# EAGLE design lpm (EAGLE 7.7.0)

## Sheet 1 of 6: Input - Relay
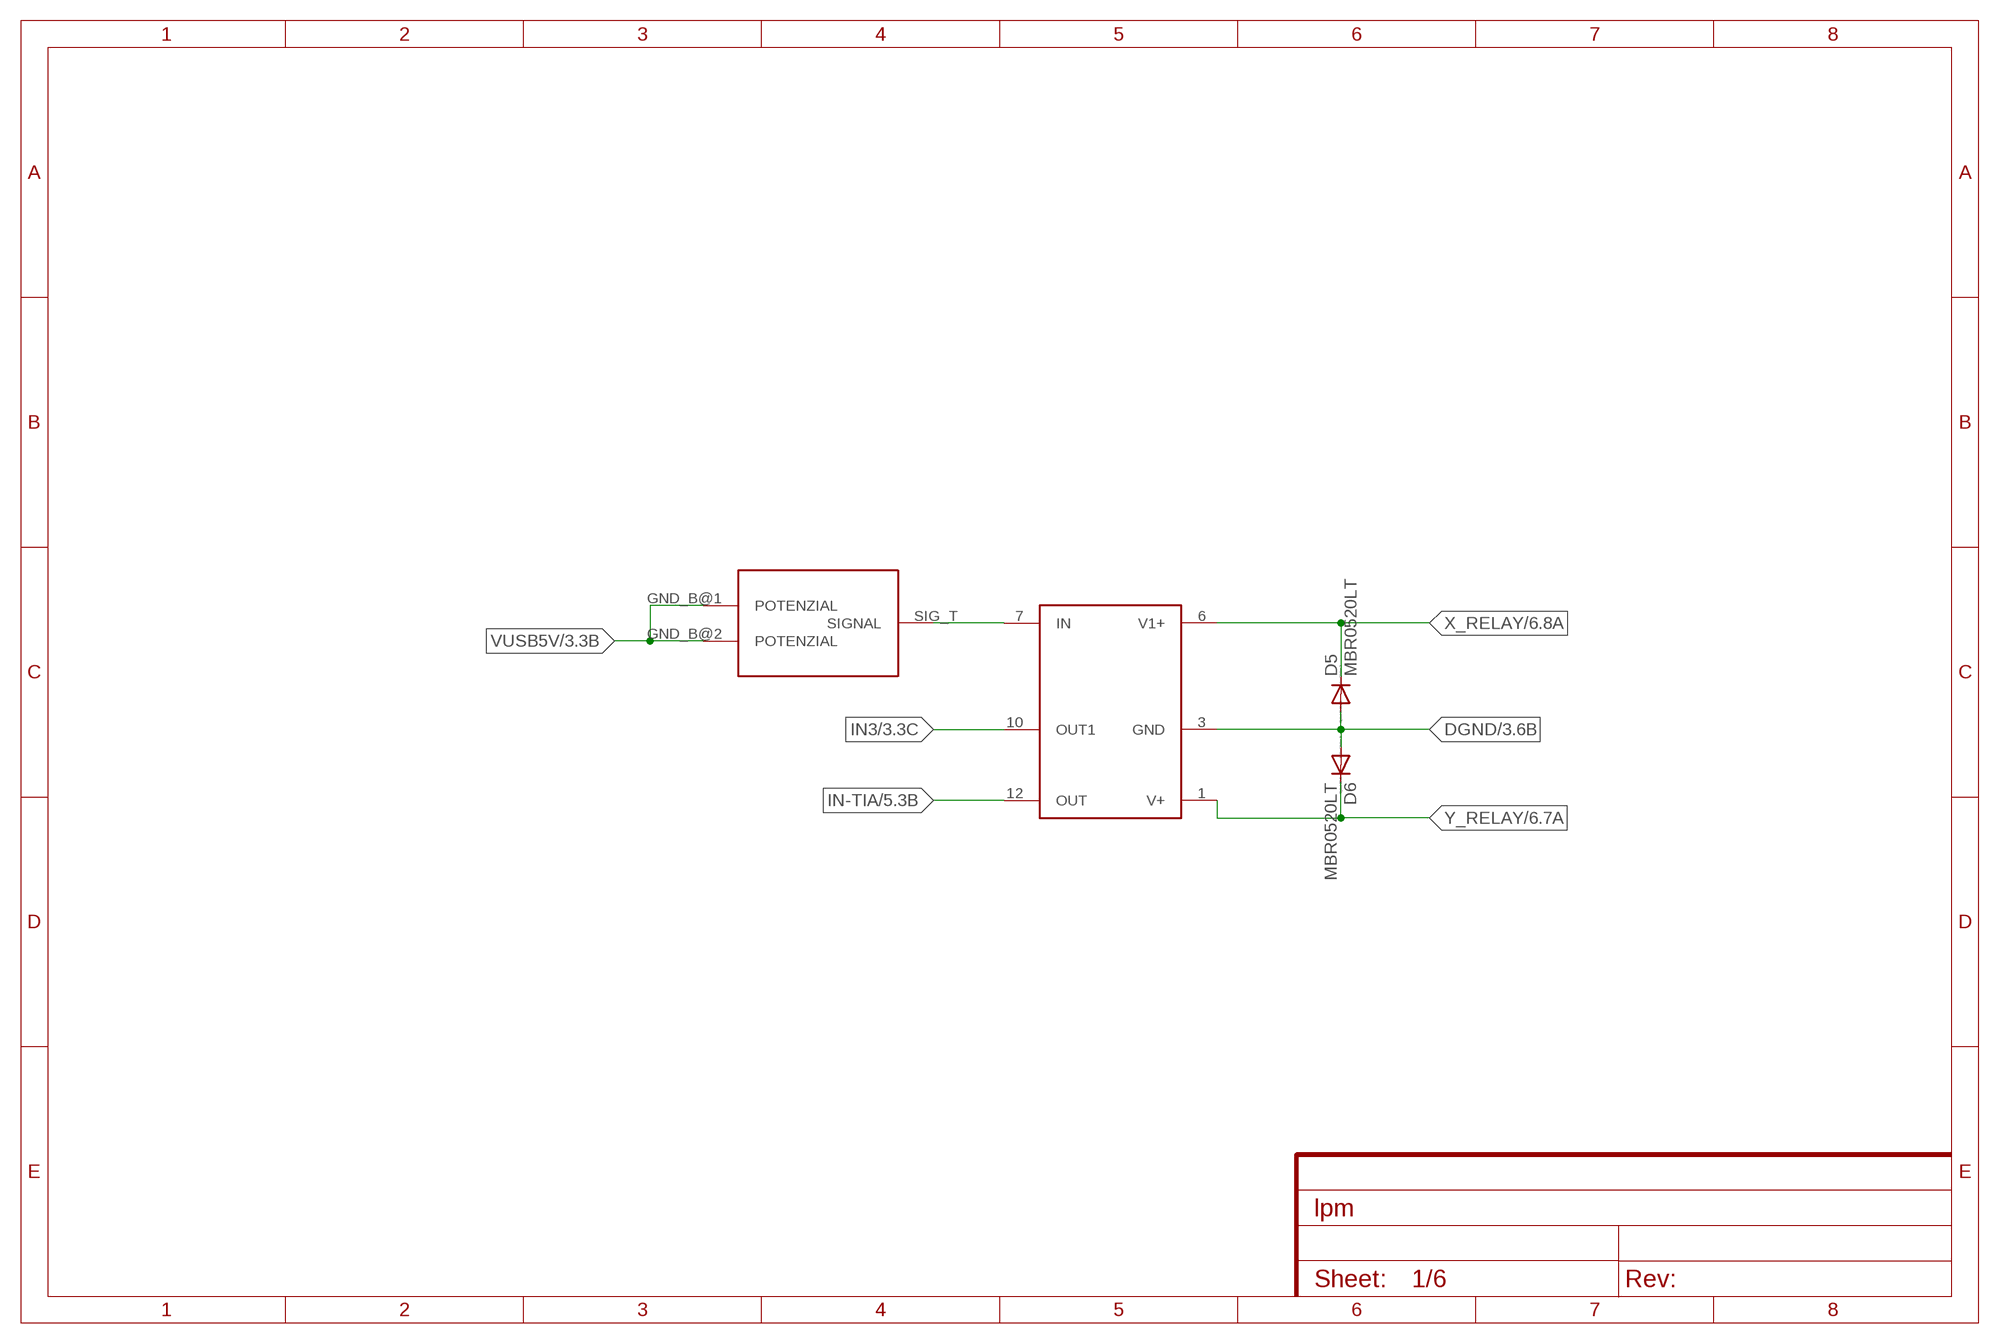
[diagram p0: schematic, sheet 1]

### Parts
D5  MBR0520LT  [SOD123]
D6  MBR0520LT  [SOD123]
RELAY  DS1E  [DIP12_8MM_X_13MM_DS1E]
U$8  SMA_RAND  [SMA-RAND-PRINT]

### Nets
DGND: D5.A D6.A RELAY.3(GND) ; also sheet 3,4,6
IN3: RELAY.10(OUT1) ; also sheet 3
IN-TIA: RELAY.12(OUT) ; also sheet 5
IPD: RELAY.7(IN) U$8.SIG_T(SIGNAL)
VUSB5V: U$8.GND_B@1(POTENZIAL) U$8.GND_B@2(POTENZIAL) ; also sheet 3,4,6
X_RELAY: D5.C RELAY.6(V1+) ; also sheet 6
Y_RELAY: D6.C RELAY.1(V+) ; also sheet 6

## Sheet 2 of 6: VFC
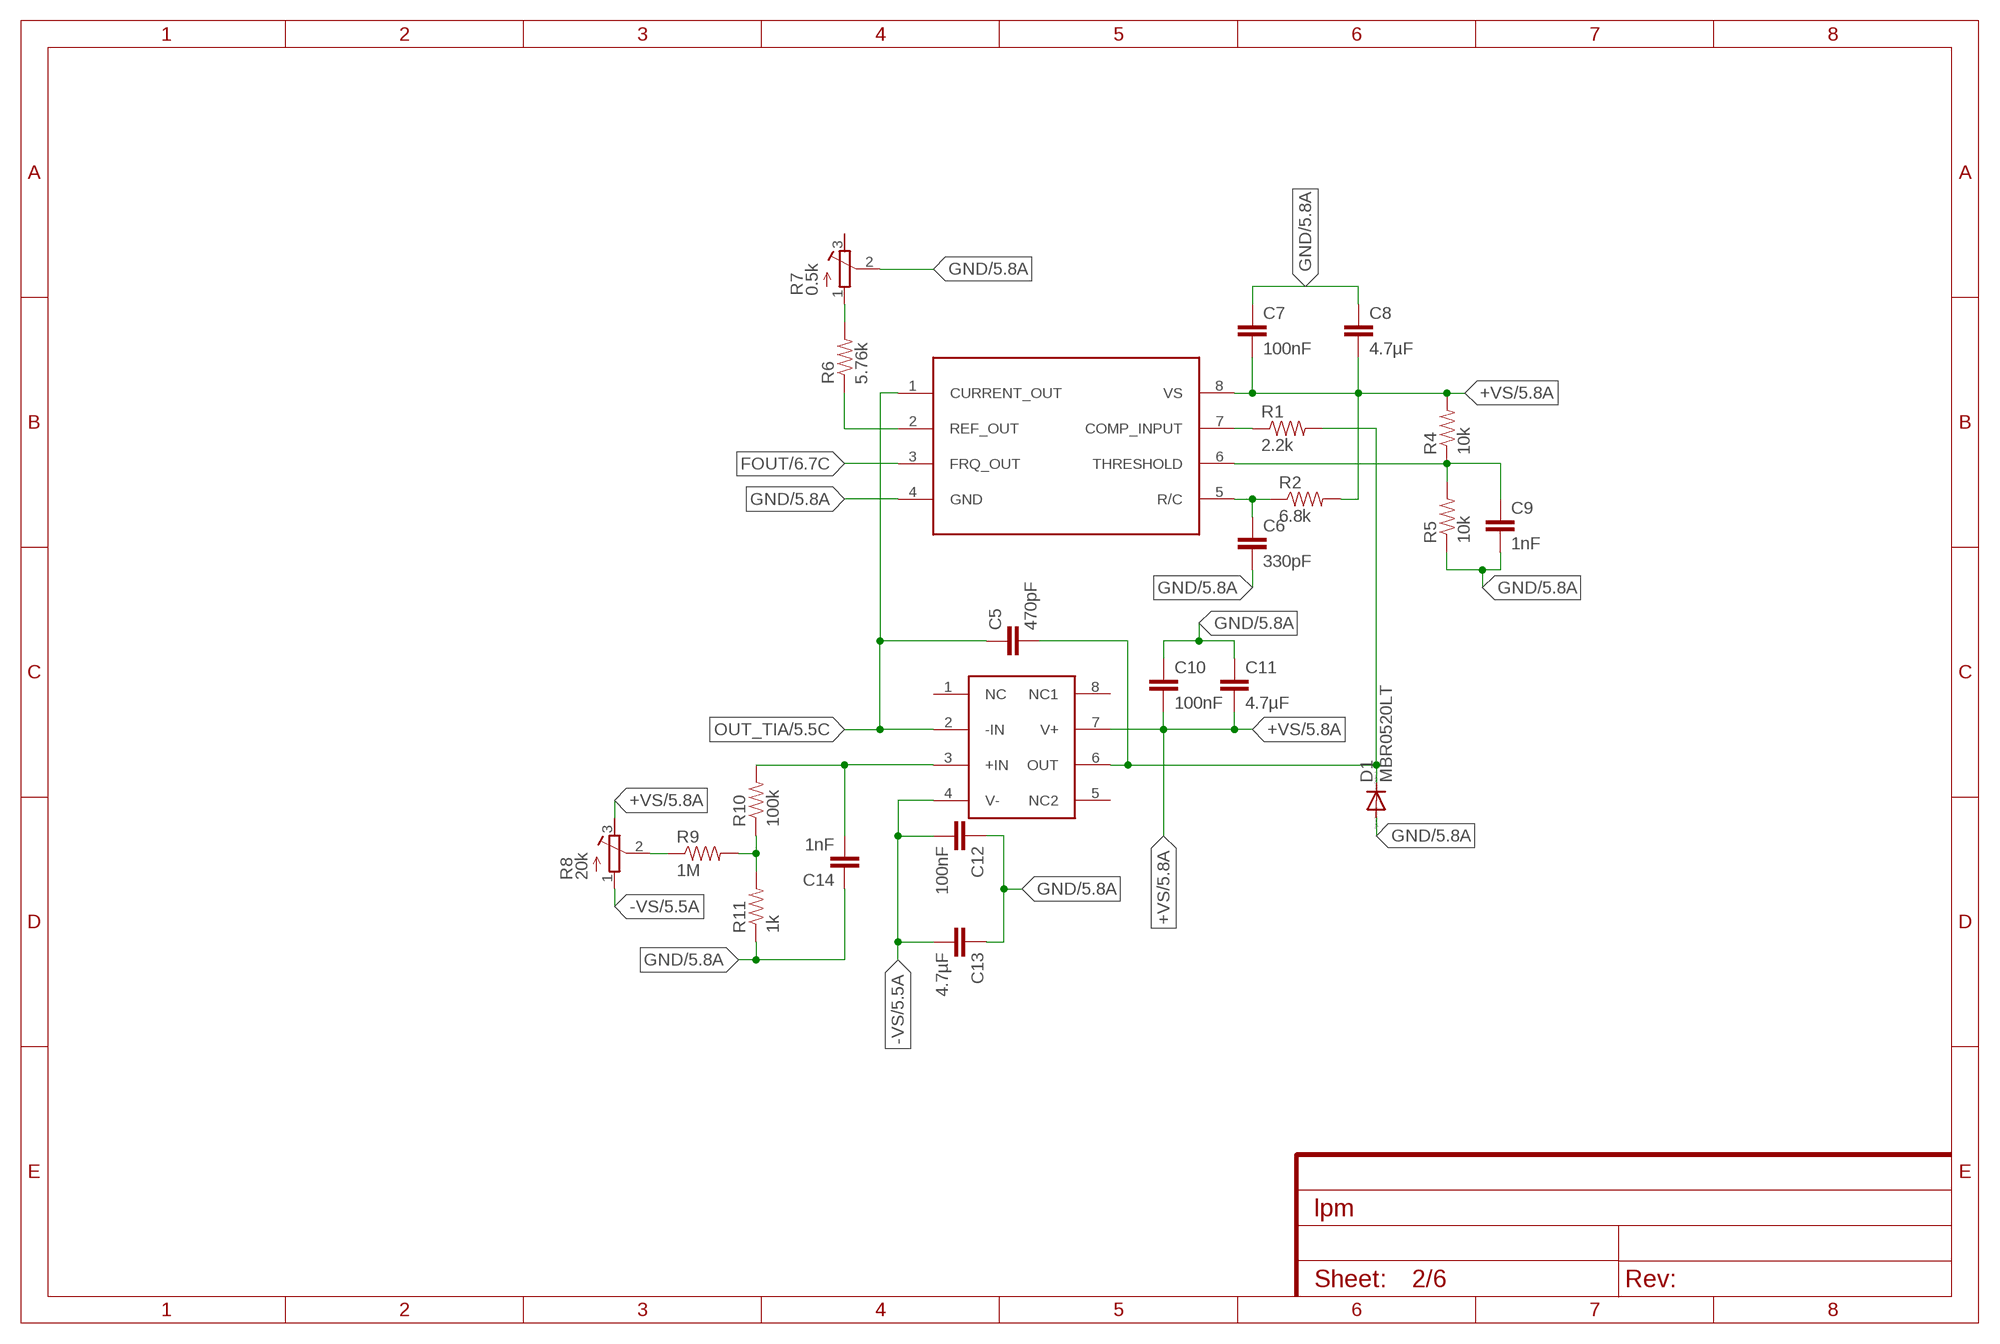
[diagram p1: schematic, sheet 2]

### Parts
C5  470pF  CAP0603-CAP  [0603-CAP]
C6  330pF  C-EUC0603K  [C0603K]
C7  100nF  C-EUC0603K  [C0603K]
C8  4.7µF  C-EUC0603K  [C0603K]
C9  1nF  C-EUC0603K  [C0603K]
C10  100nF  C-EUC0603K  [C0603K]
C11  4.7µF  C-EUC0603K  [C0603K]
C12  100nF  C-EUC0603K  [C0603K]
C13  4.7µF  C-EUC0603K  [C0603K]
C14  1nF  C-EUC0603K  [C0603K]
D1  MBR0520LT  [SOD123]
R1  2.2k  RESISTOR0603-RES  [0603-RES]
R2  6.8k  RESISTOR0805-RES  [0805]
R4  10k  RESISTOR0603-RES  [0603-RES]
R5  10k  RESISTOR0603-RES  [0603-RES]
R6  5.76k  RESISTOR0603-RES  [0603-RES]
R7  0.5k  R-TRIMMTSM53YL  [RTRIMTSM53YL]
R8  20k  R-TRIMMTS63Y  [RTRIMTS63Y]
R9  1M  RESISTOR0603-RES  [0603-RES]
R10  100k  RESISTOR0603-RES  [0603-RES]
R11  1k  RESISTOR0603-RES  [0603-RES]
U$10  OPA191  [SOIC8_4.90MMX3.91MM]
VFC  LM331  [DIP-08]

### Nets
+VS: C7.2 C8.2 C10.2 C11.2 R2.2 R4.2 R8.3(E) U$10.7(V+) VFC.8(VS) ; also sheet 5,6
-VS: C12.2 C13.2 R8.1(A) U$10.4(V-) ; also sheet 5,6
COMP_IN: R1.1 VFC.7(COMP_INPUT)
FOUT: VFC.3(FRQ_OUT) ; also sheet 6
GND: C6.2 C7.1 C8.1 C9.2 C10.1 C11.1 C12.1 C13.1 C14.1 D1.A R5.1 R7.2(S) R11.1 VFC.4(GND) ; also sheet 5,6
IN+INTE: C14.2 R10.2 U$10.3(+IN)
N$2: C5.2 D1.C R1.2 U$10.6(OUT)
N$8: C6.1 R2.1 VFC.5(R/C)
N$10: R6.1 VFC.2(REF_OUT)
N$11: C9.1 R4.1 R5.2 VFC.6(THRESHOLD)
N$12: R6.2 R7.1(A)
N$14: R9.2 R10.1 R11.2
N$15: R8.2(S) R9.1
OUT_TIA: C5.1 U$10.2(-IN) VFC.1(CURRENT_OUT) ; also sheet 5
Unconnected: R7.3(E) U$10.1(NC) U$10.5(NC2) U$10.8(NC1)

## Sheet 3 of 6: Mazet + Supply
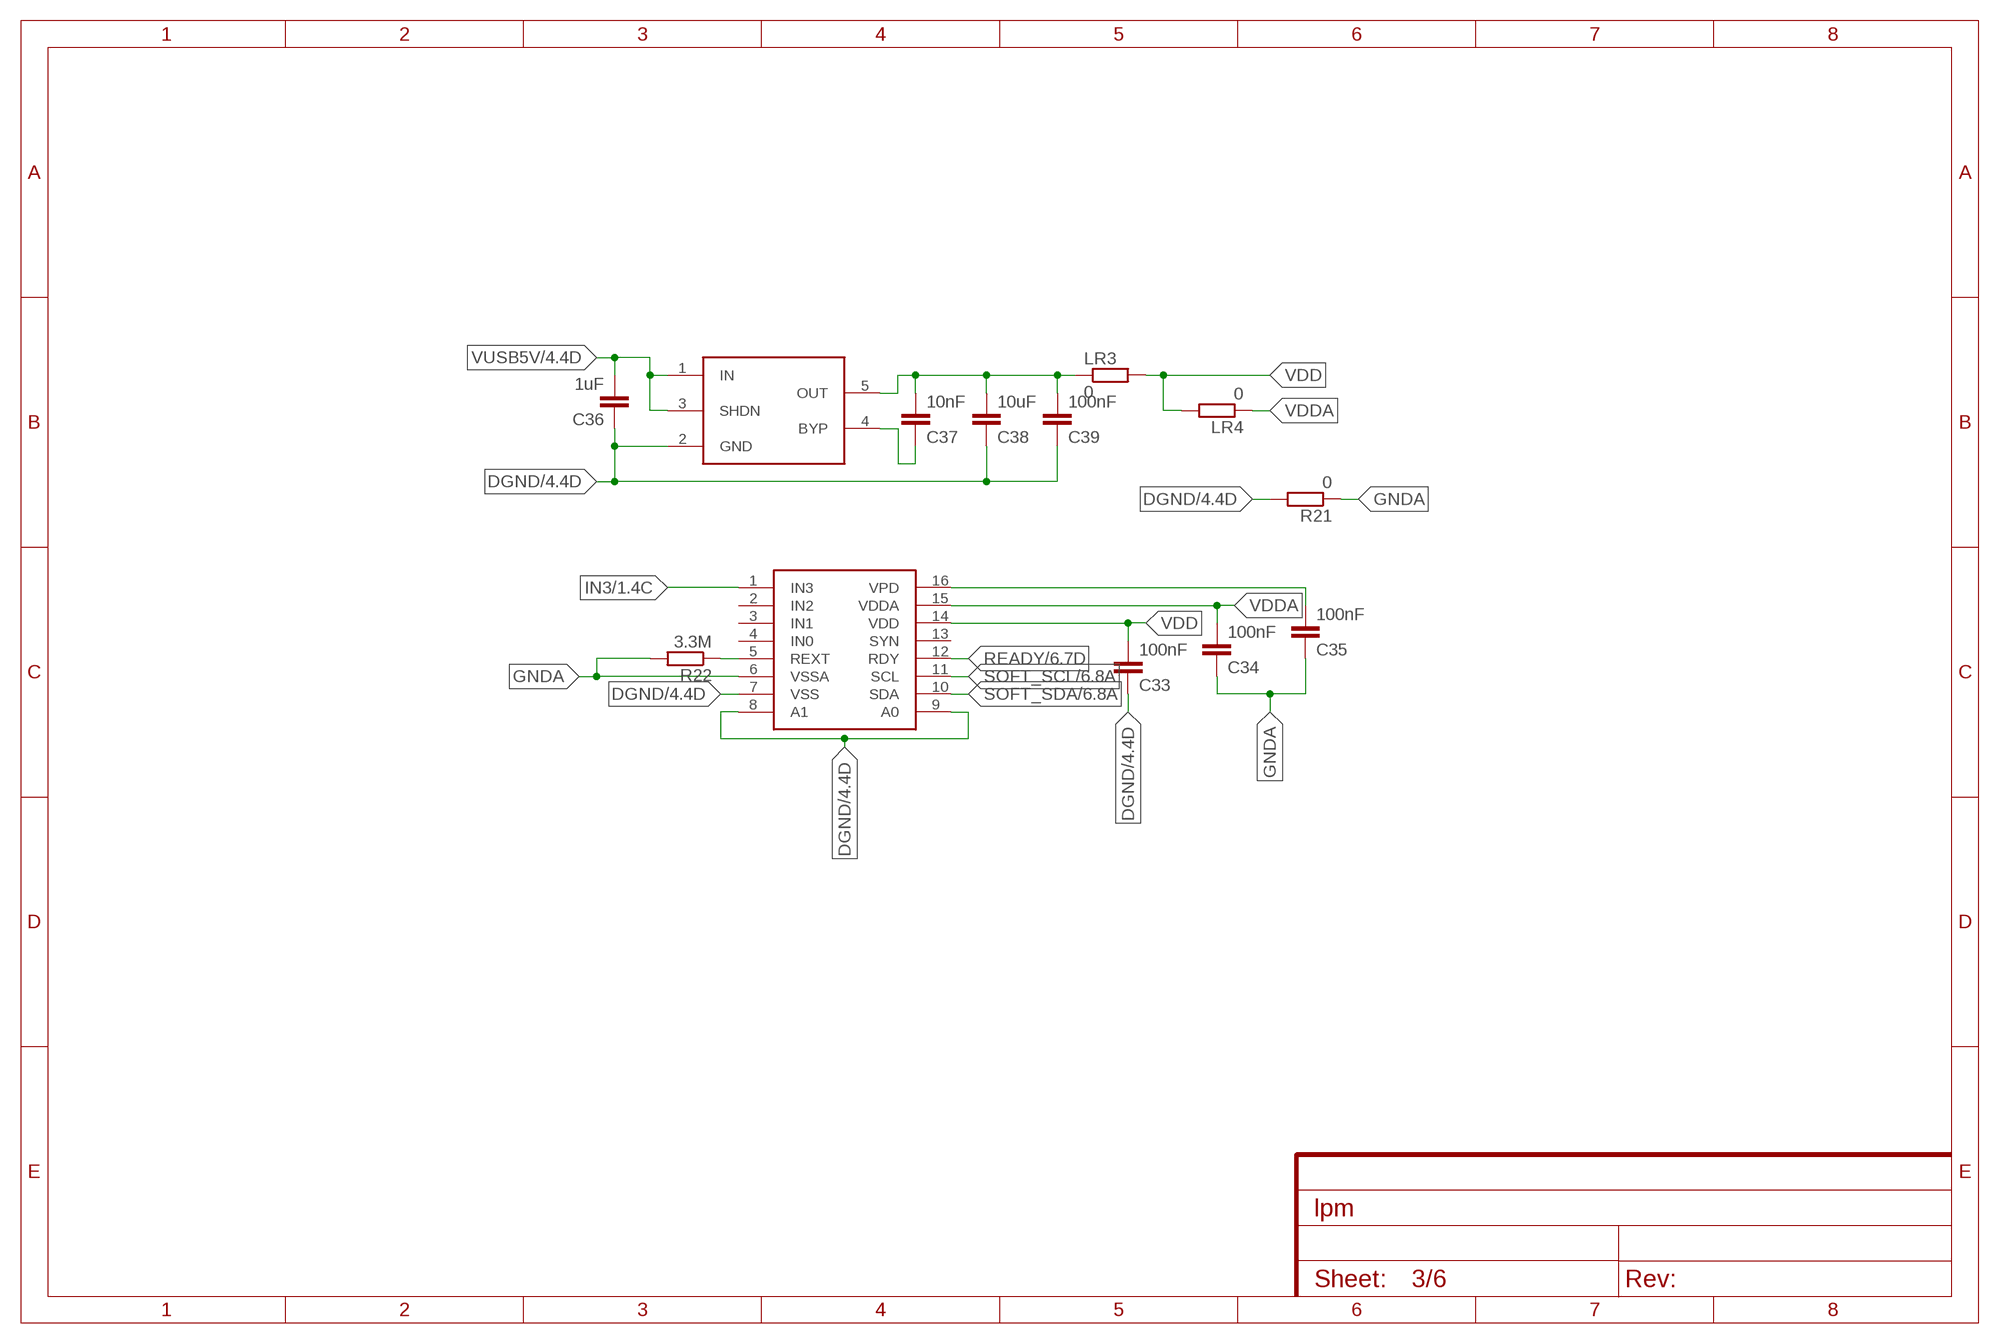
[diagram p2: schematic, sheet 3]

### Parts
C33  100nF  C-EUC0603  [C0603]
C34  100nF  C-EUC0603  [C0603]
C35  100nF  C-EUC0603  [C0603]
C36  1uF  C-EUC0603  [C0603]
C37  10nF  C-EUC0603  [C0603]
C38  10uF  C-EUC0603  [C0603]
C39  100nF  C-EUC0603  [C0603]
LDO1  LT1761  [TSOT23-5]
LR3  0  R-EU_R0603  [R0603]
LR4  0  R-EU_R0603  [R0603]
MCDC01  MCDC04  [SSOP16]
R21  0  R-EU_R0603  [R0603]
R22  3.3M  R-EU_R0603  [R0603]

### Nets
DGND: C33.1 C36.1 C38.1 C39.1 LDO1.2(GND) MCDC01.7(VSS) MCDC01.8(A1) MCDC01.9(A0) R21.2 ; also sheet 1,4,6
GNDA: C34.1 C35.1 MCDC01.6(VSSA) R21.1 R22.2
IN3: MCDC01.1(IN3) ; also sheet 1
LDO_OUT3V1: C37.2 C38.2 C39.2 LDO1.5(OUT) LR3.1
N$1: C37.1 LDO1.4(BYP)
READY: MCDC01.12(RDY) ; also sheet 6
REXT: MCDC01.5(REXT) R22.1
SOFT_SCL: MCDC01.11(SCL) ; also sheet 6
SOFT_SDA: MCDC01.10(SDA) ; also sheet 6
VDD: C33.2 LR3.2 LR4.2 MCDC01.14(VDD)
VDDA: C34.2 LR4.1 MCDC01.15(VDDA)
VPD: C35.2 MCDC01.16(VPD)
VUSB5V: C36.2 LDO1.1(IN) LDO1.3(SHDN) ; also sheet 1,4,6
Unconnected: MCDC01.2(IN2) MCDC01.3(IN1) MCDC01.4(IN0) MCDC01.13(SYN)

## Sheet 4 of 6: Display Joystik
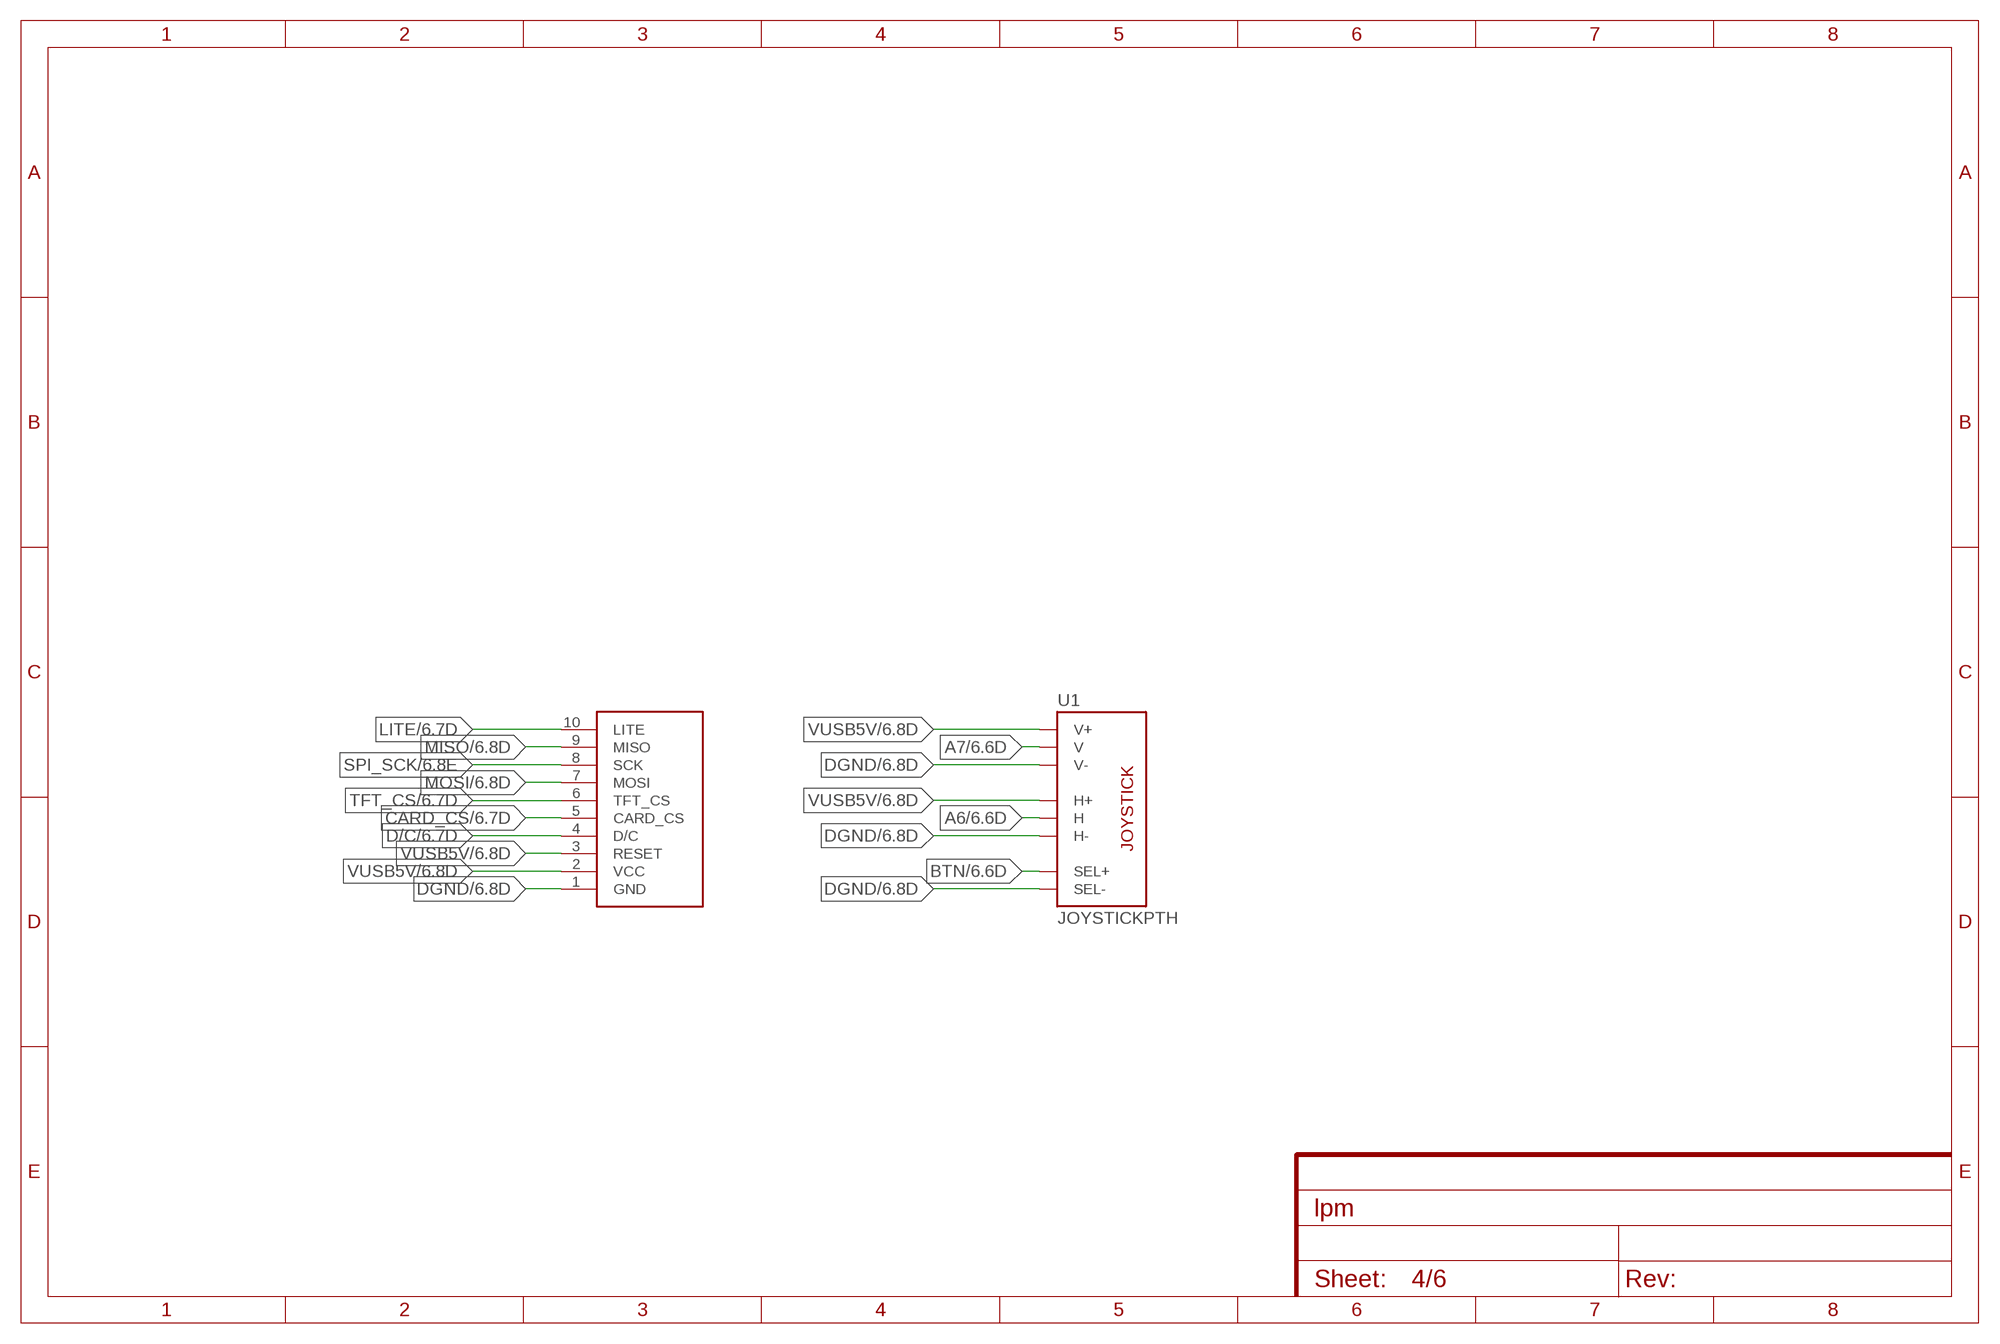
[diagram p3: schematic, sheet 4]

### Parts
DISPLAY  DISPLAY  [DISPLAY]
U1  JOYSTICKPTH  [JOYSTICK]

### Nets
A6: U1.H2(H) ; also sheet 6
A7: U1.V2(V) ; also sheet 6
BTN: U1.B1A(SEL+) ; also sheet 6
CARD_CS: DISPLAY.5(CARD_CS) ; also sheet 6
D/C: DISPLAY.4(D/C) ; also sheet 6
DGND: DISPLAY.1(GND) U1.B2A(SEL-) U1.H3(H-) U1.V3(V-) ; also sheet 1,3,6
LITE: DISPLAY.10(LITE) ; also sheet 6
MISO: DISPLAY.9(MISO) ; also sheet 6
MOSI: DISPLAY.7(MOSI) ; also sheet 6
SPI_SCK: DISPLAY.8(SCK) ; also sheet 6
TFT_CS: DISPLAY.6(TFT_CS) ; also sheet 6
VUSB5V: DISPLAY.2(VCC) DISPLAY.3(RESET) U1.H1(H+) U1.V1(V+) ; also sheet 1,3,6

## Sheet 5 of 6: TIA
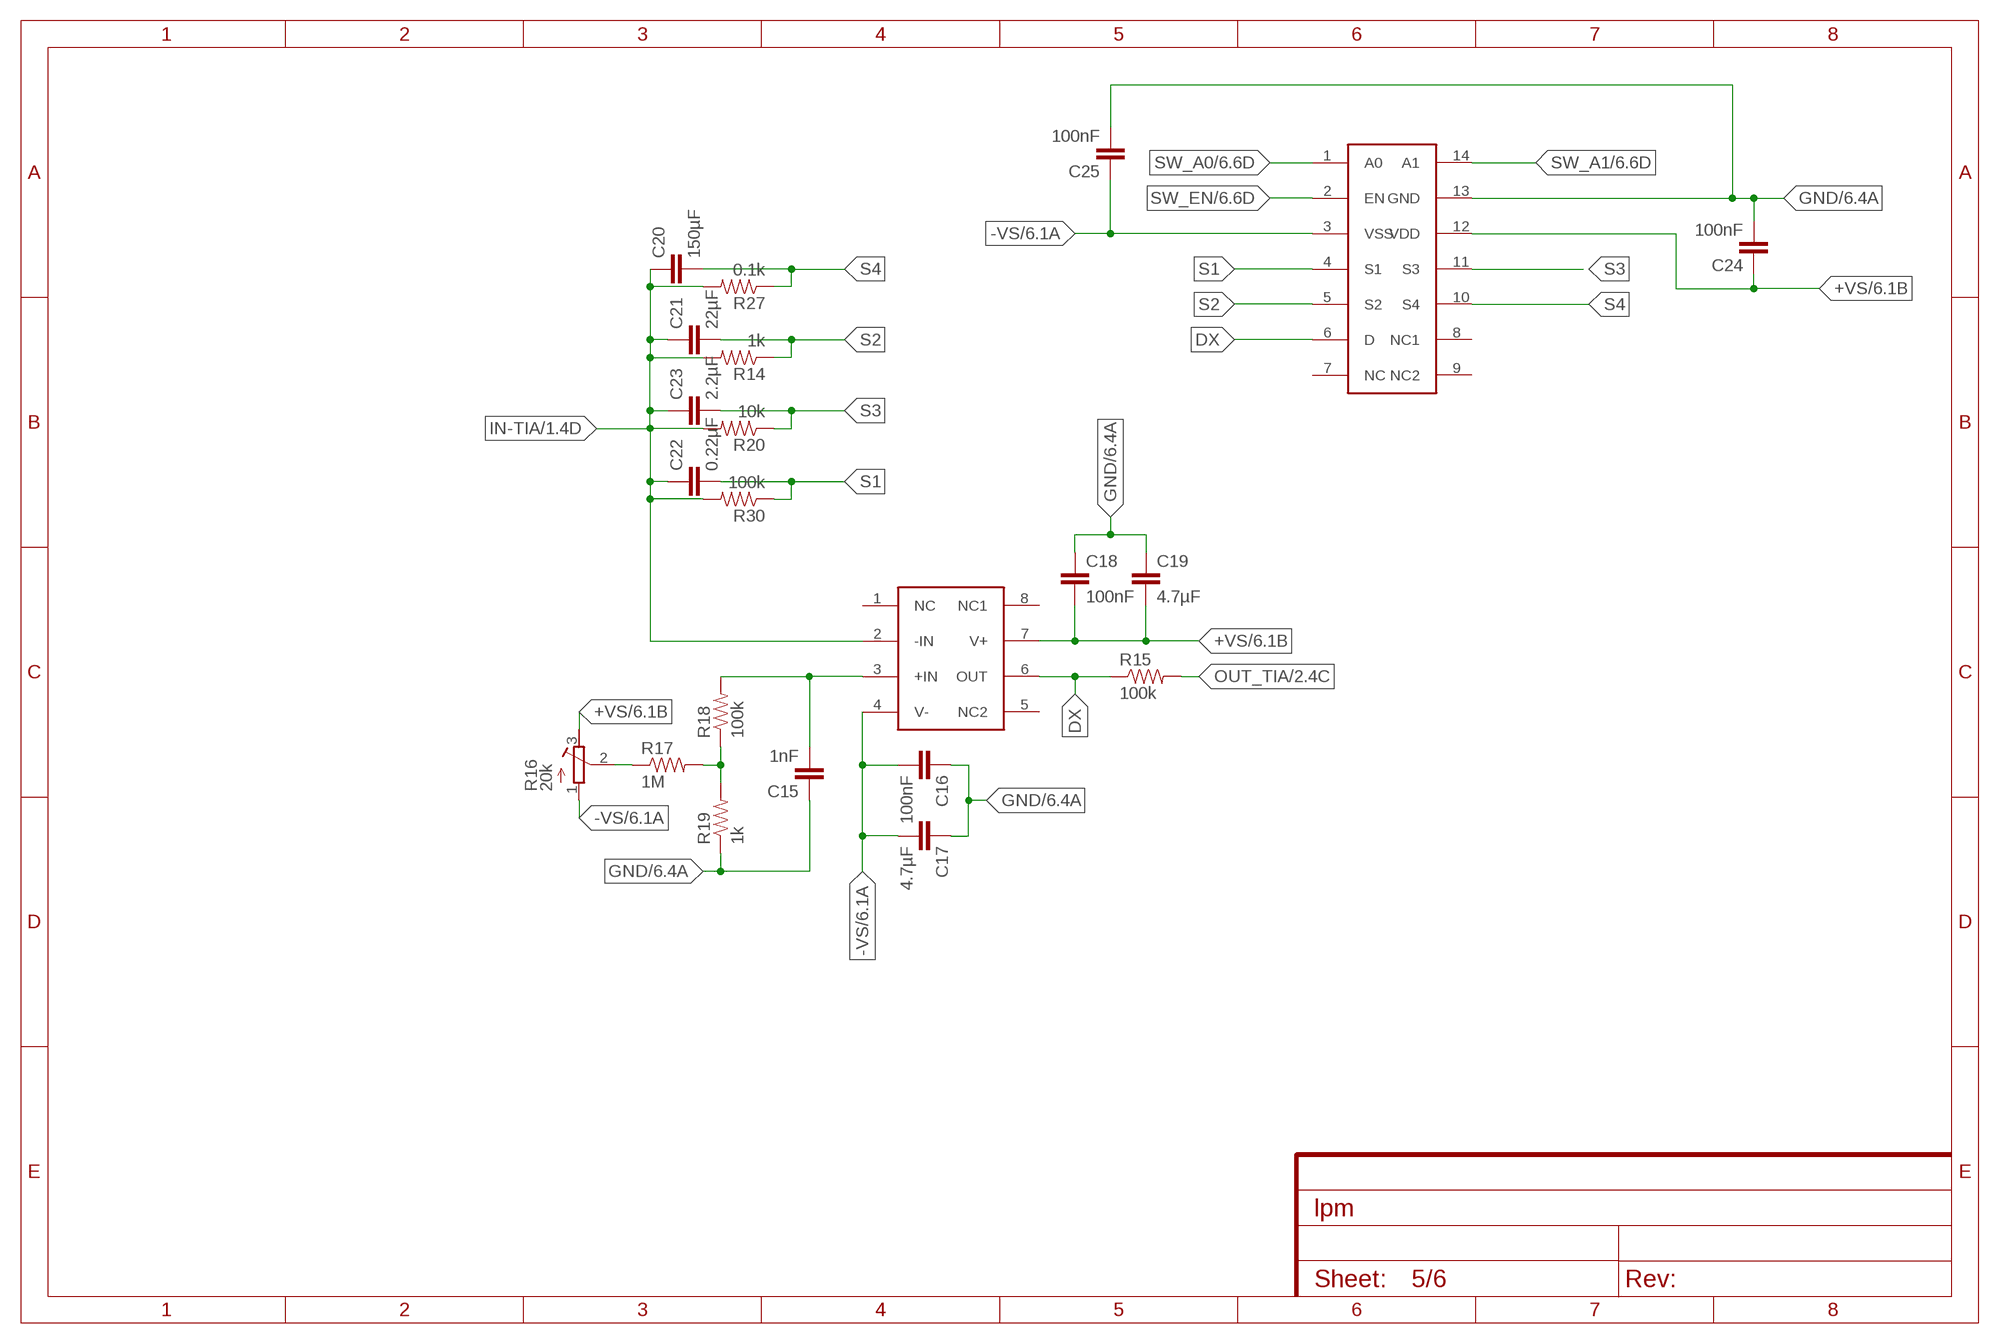
[diagram p4: schematic, sheet 5]

### Parts
C15  1nF  C-EUC0603K  [C0603K]
C16  100nF  C-EUC0603K  [C0603K]
C17  4.7µF  C-EUC0603K  [C0603K]
C18  100nF  C-EUC0603K  [C0603K]
C19  4.7µF  C-EUC0603K  [C0603K]
C20  150µF  C-EUC1206  [C1206]
C21  22µF  C-EUC0805  [C0805]
C22  0.22µF  C-EUC0603  [C0603]
C23  2.2µF  C-EUC0805  [C0805]
C24  100nF  C-EUC0603K  [C0603K]
C25  100nF  C-EUC0603K  [C0603K]
R14  1k  RESISTOR0603-RES  [0603-RES]
R15  100k  RESISTOR0603-RES  [0603-RES]
R16  20k  R-TRIMMTS63Y  [RTRIMTS63Y]
R17  1M  RESISTOR0603-RES  [0603-RES]
R18  100k  RESISTOR0603-RES  [0603-RES]
R19  1k  RESISTOR0603-RES  [0603-RES]
R20  10k  RESISTOR0603-RES  [0603-RES]
R27  0.1k  RESISTOR1206  [1206]
R30  100k  RESISTOR0603-RES  [0603-RES]
U$1  ADG1404  [TSSOP14-0.65-5X4.4MM]
U$12  OPA191  [SOIC8_4.90MMX3.91MM]

### Nets
+VS: C18.2 C19.2 C24.1 R16.3(E) U$1.12(VDD) U$12.7(V+) ; also sheet 2,6
-VS: C16.2 C17.2 C25.1 R16.1(A) U$1.3(VSS) U$12.4(V-) ; also sheet 2,6
DX: R15.1 U$1.6(D) U$12.6(OUT)
GND: C15.1 C16.1 C17.1 C18.1 C19.1 C24.2 C25.2 R19.1 U$1.13(GND) ; also sheet 2,6
IN+TIA: C15.2 R18.2 U$12.3(+IN)
IN-TIA: C20.1 C21.1 C22.1 C23.1 R14.2 R20.2 R27.2 R30.2 U$12.2(-IN) ; also sheet 1
N$21: R17.2 R18.1 R19.2
N$22: R16.2(S) R17.1
OUT_TIA: R15.2 ; also sheet 2
S1: C22.2 R30.1 U$1.4(S1)
S2: C21.2 R14.1 U$1.5(S2)
S3: C23.2 R20.1 U$1.11(S3)
S4: C20.2 R27.1 U$1.10(S4)
SW_A0: U$1.1(A0) ; also sheet 6
SW_A1: U$1.14(A1) ; also sheet 6
SW_EN: U$1.2(EN) ; also sheet 6
Unconnected: U$1.7(NC) U$1.8(NC1) U$1.9(NC2) U$12.1(NC) U$12.5(NC2) U$12.8(NC1)

## Sheet 6 of 6: µC-Nano Versorgung
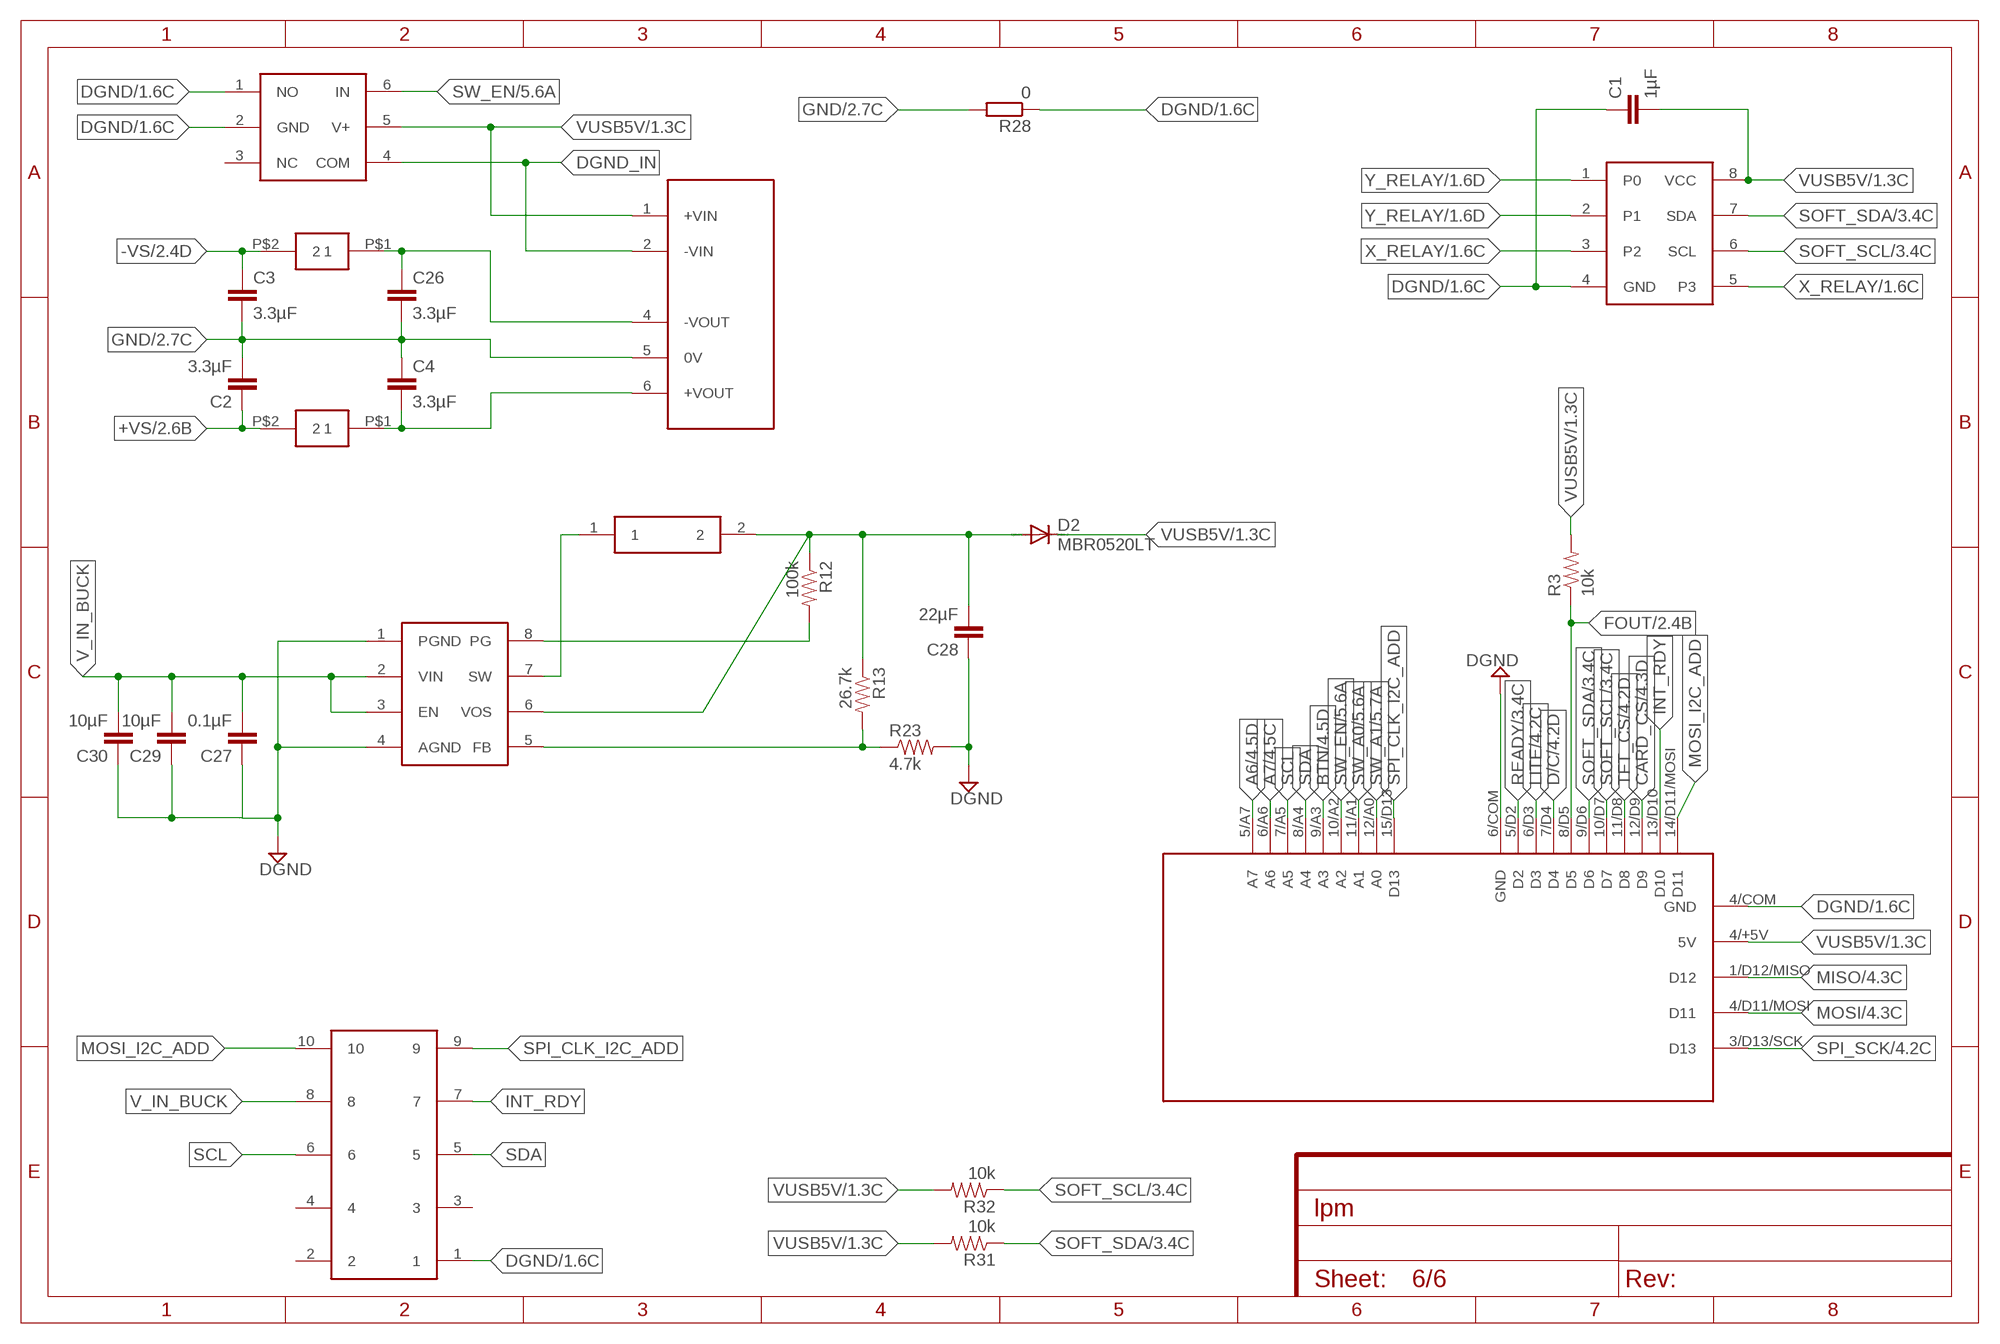
[diagram p5: schematic, sheet 6]

### Parts
C1  1µF  C-EUC0603K  [C0603K]
C2  3.3µF  C-EUC0603K  [C0603K]
C3  3.3µF  C-EUC0603K  [C0603K]
C4  3.3µF  C-EUC0603K  [C0603K]
C26  3.3µF  C-EUC0603K  [C0603K]
C27  0.1µF  C-EUC0603K  [C0603K]
C28  22µF  C-EUC0603K  [C0603K]
C29  10µF  C-EUC0603K  [C0603K]
C30  10µF  C-EUC0603K  [C0603K]
D2  MBR0520LT  [SOD123]
R3  10k  RESISTOR0603-RES  [0603-RES]
R12  100k  RESISTOR0603-RES  [0603-RES]
R13  26.7k  RESISTOR0603-RES  [0603-RES]
R23  4.7k  RESISTOR0603-RES  [0603-RES]
R28  0  R-EU_R0603  [R0603]
R31  10k  RESISTOR0603-RES  [0603-RES]
R32  10k  RESISTOR0603-RES  [0603-RES]
U$2  KMP_100µH  KMP  [KMP]
U$3  HEADER_10POL  [BOX_HEADER_2.54MM]
U$4  KMP_100µH  KMP  [KMP]
U$6  TS5A3159A  [SOT23-6]
U$7  0  PCA9536  [SOIC8_4.90MMX3.91MM]
U$9  LPS3015  [LPS3015]
U$11  NMA0515SC  [SIP7]
U$13  NANO_V2  [NANO_V2]
U$14  TPS62160  [POWER-SOP8]

### Nets
5.5VBUCK: C28.2 D2.A R12.1 R13.1 U$9.2 U$14.6(VOS)
+VS: C2.1 U$4.P$2 ; also sheet 2,5
-VS: C3.1 U$2.P$2 ; also sheet 2,5
A6: U$13.5/A7(A7) ; also sheet 4
A7: U$13.6/A6(A6) ; also sheet 4
BTN: U$13.9/A3(A3) ; also sheet 4
CARD_CS: U$13.12/D9(D9) ; also sheet 4
D/C: U$13.7/D4(D4) ; also sheet 4
DGND: C1.1 C27.1 C28.1 C29.1 C30.1 R23.2 R28.1 U$3.1 U$6.1(NO) U$6.2(GND) U$7.4(GND) U$13.4/COM(GND) U$13.6/COM(GND) U$14.1(PGND) U$14.4(AGND) ; also sheet 1,3,4
DGND_IN: U$6.4(COM) U$11.2(-VIN)
FOUT: R3.1 U$13.8/D5(D5) ; also sheet 2
GND: C2.2 C3.2 C4.1 C26.2 R28.2 U$11.5(0V) ; also sheet 2,5
INT_RDY: U$3.7 U$13.13/D10(D10)
LITE: U$13.6/D3(D3) ; also sheet 4
MISO: U$13.1/D12/MISO(D12) ; also sheet 4
MOSI: U$13.4/D11/MOSI(D11) ; also sheet 4
MOSI_I2C_ADD: U$3.10 U$13.14/D11/MOSI(D11)
N$4: C4.2 U$4.P$1 U$11.6(+VOUT)
N$6: C26.1 U$2.P$1 U$11.4(-VOUT)
N$7: R13.2 R23.1 U$14.5(FB)
N$17: R12.2 U$14.8(PG)
N$18: U$9.1 U$14.7(SW)
READY: U$13.5/D2(D2) ; also sheet 3
SCL: U$3.6 U$13.7/A5(A5)
SDA: U$3.5 U$13.8/A4(A4)
SOFT_SCL: R32.1 U$7.6(SCL) U$13.10/D7(D7) ; also sheet 3
SOFT_SDA: R31.1 U$7.7(SDA) U$13.9/D6(D6) ; also sheet 3
SPI_CLK_I2C_ADD: U$3.9 U$13.15/D13(D13)
SPI_SCK: U$13.3/D13/SCK(D13) ; also sheet 4
SW_A0: U$13.11/A1(A1) ; also sheet 5
SW_A1: U$13.12/A0(A0) ; also sheet 5
SW_EN: U$6.6(IN) U$13.10/A2(A2) ; also sheet 5
TFT_CS: U$13.11/D8(D8) ; also sheet 4
V_IN_BUCK: C27.2 C29.2 C30.2 U$3.8 U$14.2(VIN) U$14.3(EN)
VUSB5V: C1.2 D2.C R3.2 R31.2 R32.2 U$6.5(V+) U$7.8(VCC) U$11.1(+VIN) U$13.4/+5V(5V) ; also sheet 1,3,4
X_RELAY: U$7.3(P2) U$7.5(P3) ; also sheet 1
Y_RELAY: U$7.1(P0) U$7.2(P1) ; also sheet 1
Unconnected: U$3.2 U$3.3 U$3.4 U$6.3(NC)

## Library data of the parts
C1-C4 C6-C30 C33-C39 = rcl:C-EU: CAPACITOR, European symbol
C5 = SparkFun-Passives:CAP: Capacitor Standard 0603 ceramic capacitor, and 0.1" leaded capacitor.
D1 D2 D5 D6 = VFC_lib:MBR0520LT: SCHOTTKY BARRIER RECTIFIER Source: http://onsemi.com .. MBR0520LT1-D.pdf
DISPLAY = Lego:DISPLAY
LDO1 = OpenPhotonicsLib:LT1761
LR3 LR4 R21 R22 = rcl:R-EU_: RESISTOR, European symbol
MCDC01 = BachelorLib:MCDC04
R1-R6 R9-R15 R17-R20 R23 R27 R30-R32 = SparkFun-Passives:RESISTOR: Resistor Basic schematic elements and footprints for 0603, 1206, and PTH resistors.
R7 R8 R16 = resistor:R-TRIMM: Trimm resistor
R28 = resistor:R-EU_: RESISTOR, European symbol
RELAY = VFC_lib:DS1E
U1 = SparkFun-Electromechanical:JOYSTICK: Thumb Joystick Joystick commonly found in PS2 controllers. Two pots and a select switch. Footprint proven. Spark Fun Electronics SKU : COM-09032
U$1 = VFC_lib:ADG1404
U$2 U$4 = VFC_lib:KMP
U$3 = VFC_lib:HEADER_10POL
U$6 = VFC_lib:TS5A3159A
U$7 = VFC_lib:PCA9536
U$8 = VFC_lib:SMA_RAND
U$9 = VFC_lib:LPS3015
U$10 U$12 = VFC_lib:OPA191
U$11 = VFC_lib:NMA0515SC
U$13 = VFC_lib:NANO_V2
U$14 = VFC_lib:TPS62160
VFC = VFC_lib:LM331

## Board
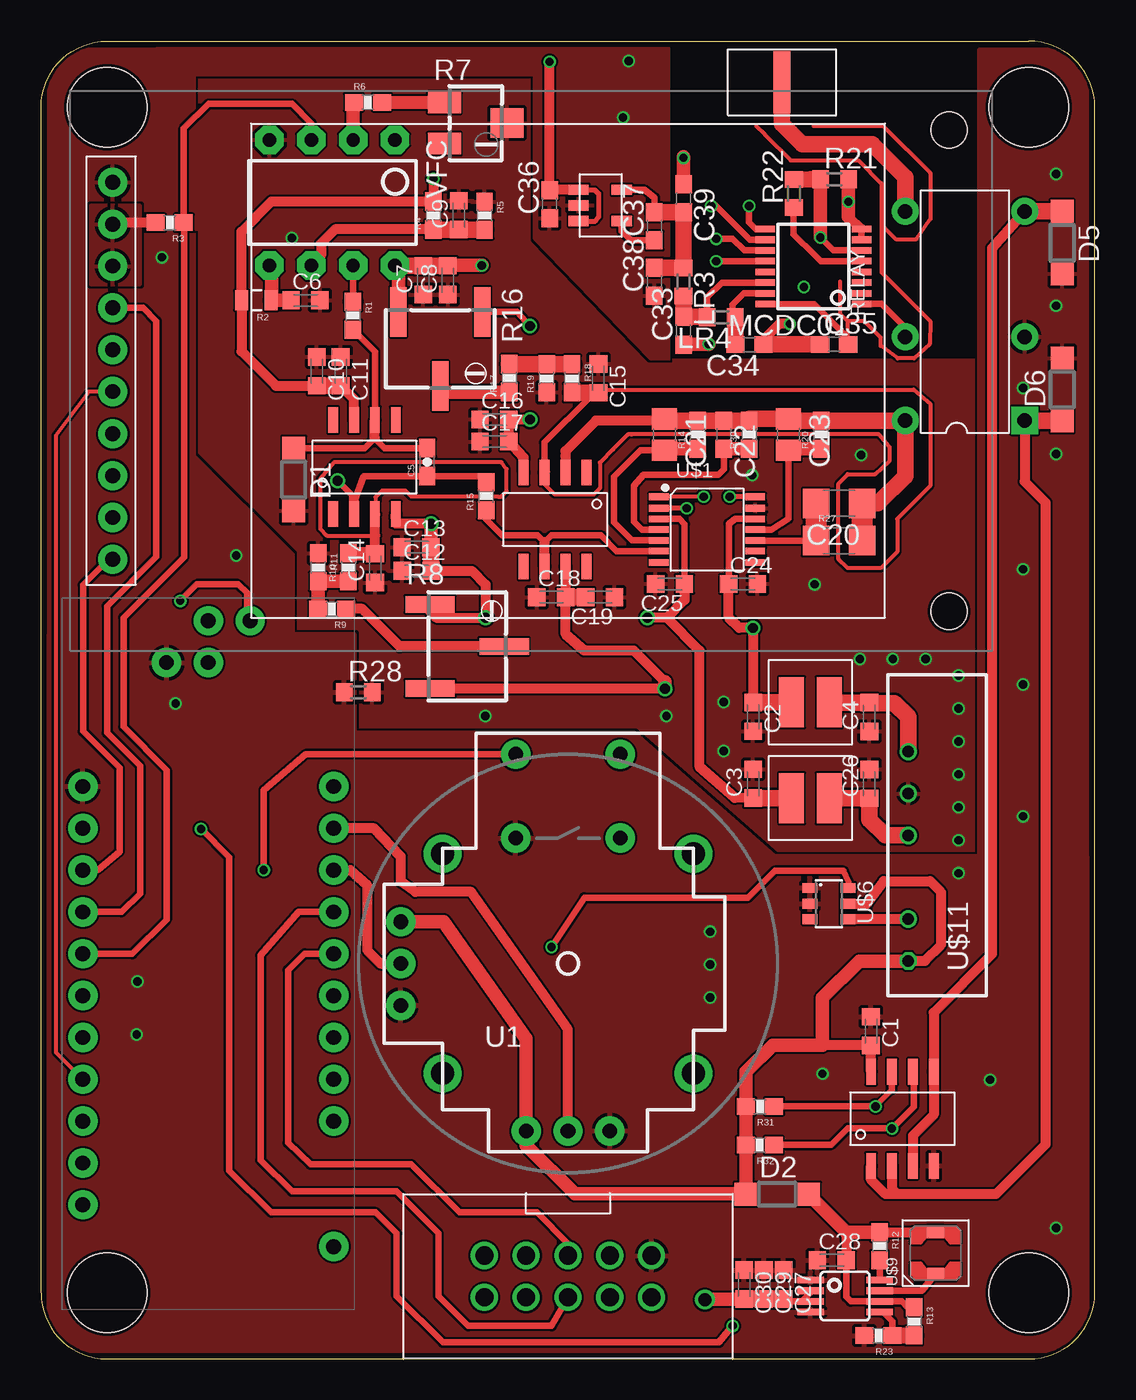
[diagram p6: board, top side]
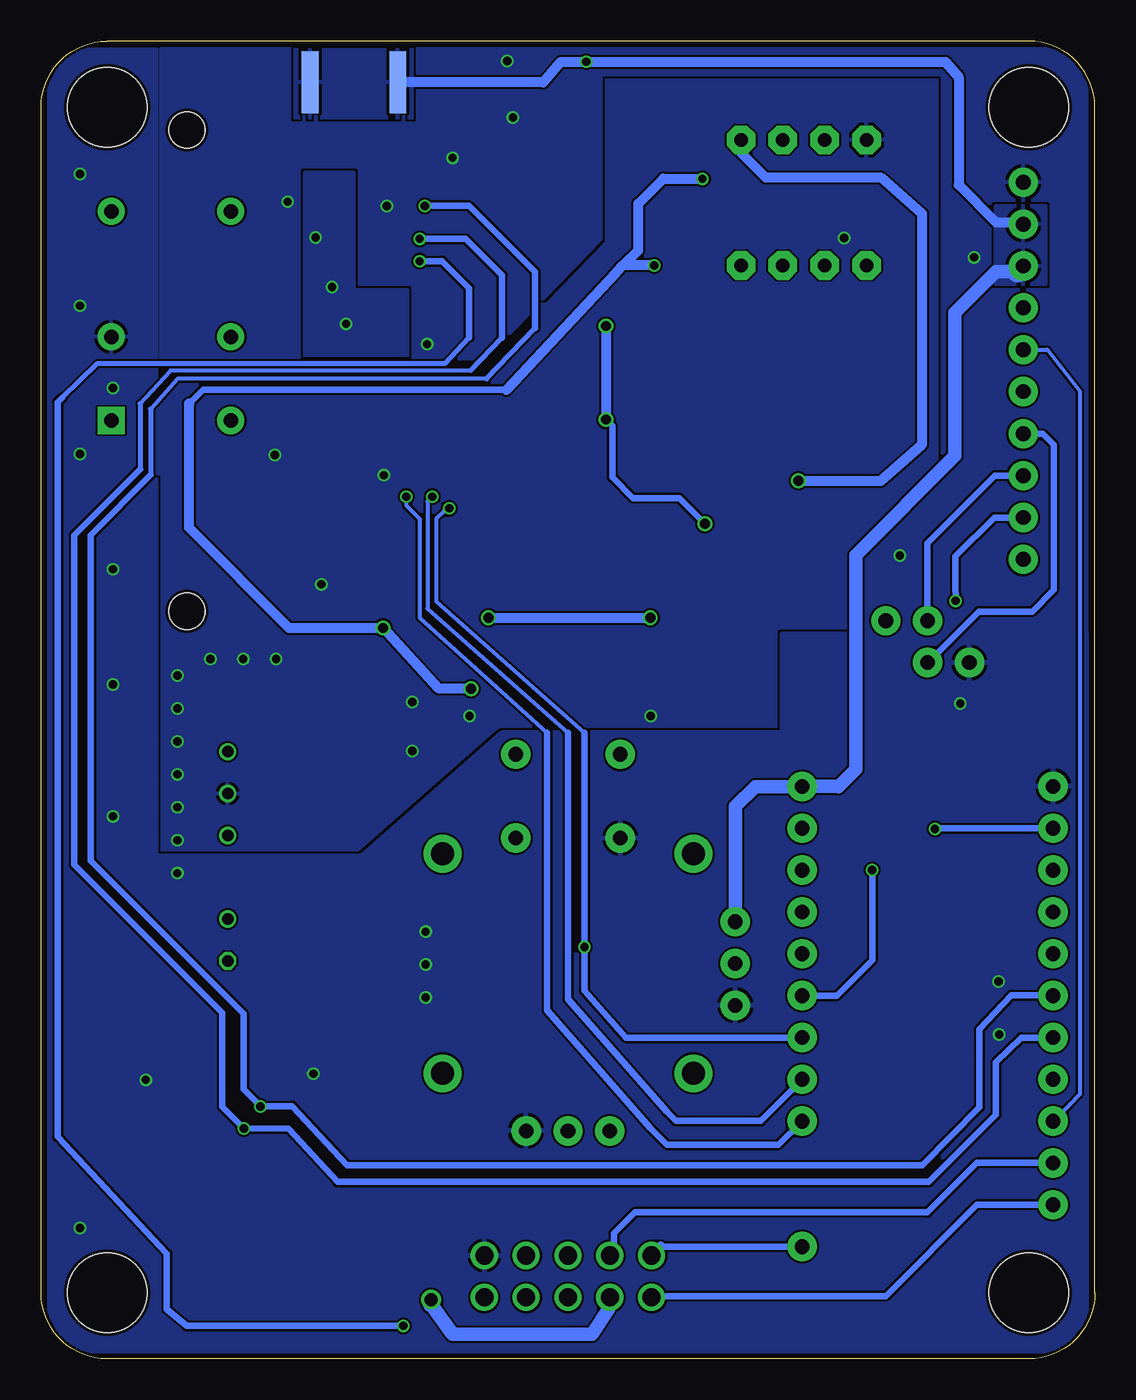
[diagram p7: board, bottom side, seen from below]

Size 64 x 80 mm. Coordinates in mm from the lower left corner, seen from the top.
Outline: 0,4 arc90 4,0 60,0 arc90 64,4 64,76 arc90 60,80 4,80 arc90 0,76 0,4
Copper layers (1*16): Top 0.018mm / dielectric 1.55mm / Bottom 0.018mm
Design rules "Multi-CB_2L_125um-Tracks_OL35um": minimum track width 0.125mm, minimum drill 0.2mm, track to track 0.125mm, track to pad 0.125mm, pad to pad 0.125mm, via to via 0.125mm, smd to smd 0mil, copper to edge 0.2mm, drill to drill 0.2mm, minimum pad ring 0.125mm, minimum via ring 0.125mm, stop-mask expansion 2mil, vias tented up to drill 0.45mm, thermal gap 0.2mm
Holes 4.82 mm at 4,76 60,76 60,4 4,4

### Footprints (pad centres in the part's own frame; a part is rotated, then mirrored left to right if it is on the bottom)
C0603K = smd 1.05 x 1.08: 1 -0.875,0; 2 0.875,0
0603-CAP = smd 1.1 x 1: 1 -0.85,0; 2 0.85,0
C1206 = smd 1.6 x 1.8: 1 -1.4,0; 2 1.4,0
C0805 = smd 1.3 x 1.5: 1 -0.95,0; 2 0.95,0
C0603 = smd 1.1 x 1: 1 -0.85,0; 2 0.85,0
SOD123 = smd 1.4 x 1.4: A 1.9,0; C -1.9,0
DISPLAY = drill 0.9 pad 1.778: 1 -25.4,11.43; 2 -25.4,8.89; 3 -25.4,6.35; 4 -25.4,3.81; 5 -25.4,1.27; 6 -25.4,-1.27; 7 -25.4,-3.84; 8 -25.4,-6.38; 9 -25.4,-8.92; 10 -25.4,-11.46 | hole 2.2: 25.4,-14.605; 25.4,14.605
TSOT23-5 = smd 0.62 x 1.22: 1 0,-2.62; 2 0.95,-2.62; 3 1.9,-2.62; 4 1.9,0; 5 0,0
R0603 = smd 1 x 1.1: 1 -0.85,0; 2 0.85,0
SSOP16 = smd 0.4 x 1.2: 1 -2.275,-2.925; 2 -1.625,-2.925; 3 -0.975,-2.925; 4 -0.325,-2.925; 5 0.325,-2.925; 6 0.975,-2.925; 7 1.625,-2.925; 8 2.275,-2.925; 9 2.275,2.925; 10 1.625,2.925; 11 0.975,2.925; 12 0.325,2.925; 13 -0.325,2.925; 14 -0.975,2.925; 15 -1.625,2.925; 16 -2.275,2.925
0603-RES = smd 1.1 x 1: 1 -0.85,0; 2 0.85,0
0805 = smd 0.8 x 1.2: 1 -0.9,0; 2 0.9,0
RTRIMTSM53YL = smd 1.3 x 2: 1 -1.25,-1.9; 3 1.25,-1.9 | smd 1.8 x 2: 2 0,1.9
RTRIMTS63Y = smd 1 x 3: 1 -2.55,-2.25; 2 0,2.25; 3 2.55,-2.25
1206 = smd 1.6 x 1.8: 1 -1.4,0; 2 1.4,0
DIP12_8MM_X_13MM_DS1E = drill 0.889 pad 1.651 square: 1 -7.62,-4.128 | drill 0.889 pad 1.651: 3 -2.54,-4.128; 6 5.08,-4.128; 7 5.08,3.127; 10 -2.54,3.127; 12 -7.62,3.127
JOYSTICK = drill 0.9 pad 1.778: B1A -3.175,12.7; B1B 3.175,12.7; B2A -3.175,7.62; B2B 3.175,7.62 | drill 0.889 pad 1.778: H1 -2.54,-10.16; H2 0,-10.16; H3 2.54,-10.16; V1 -10.16,2.54; V2 -10.16,0; V3 -10.16,-2.54 | drill 1.397 pad 2.286: MOUNT1 -7.62,6.668; MOUNT2 -7.62,-6.668; MOUNT3 7.62,-6.668; MOUNT4 7.62,6.668
TSSOP14-0.65-5X4.4MM = smd 0.4 x 1.2: 1 -2,-2.925; 2 -1.3,-2.925; 3 -0.65,-2.925; 4 0,-2.925; 5 0.65,-2.925; 6 1.3,-2.925; 7 2,-2.925; 8 2,2.925; 9 1.3,2.925; 10 0.65,2.925; 11 0,2.925; 12 -0.65,2.925; 13 -1.3,2.925; 14 -2,2.925
KMP = smd 1.52 x 3.05: P$1 -1.145,0; P$2 1.145,0
BOX_HEADER_2.54MM = drill 1.1: 1 -1.27,5.08; 2 1.27,5.08; 3 -1.27,2.54; 4 1.27,2.54; 5 -1.27,0; 6 1.27,0; 7 -1.27,-2.54; 8 1.27,-2.54; 9 -1.27,-5.08; 10 1.27,-5.08
SOT23-6 = smd 0.6 x 0.9: 1 -0.95,-1.15; 2 0,-1.15; 3 0.95,-1.15; 4 0.95,1.15; 5 0,1.15; 6 -0.95,1.15
SOIC8_4.90MMX3.91MM = smd 0.6 x 1.55: 1 -1.27,-5.715; 2 0,-5.715; 3 1.27,-5.715; 4 2.54,-5.715; 5 2.54,0; 6 1.27,0; 7 0,0; 8 -1.27,0
SMA-RAND-PRINT = smd 3.75 x 1.02 bottom: GND_B@1 0,2.665; GND_B@2 0,-2.665 | smd 3.75 x 1.02: SIG_T 0,0
LPS3015 = smd 0.76 x 1.02: 1 -1.27,0; 2 1.27,0.01
SIP7 = drill 0.7 pad 1.016 octagon: 1 -7.62,1.75 | drill 0.7 pad 1.016: 2 -5.08,1.75; 4 0,1.75; 5 2.54,1.75; 6 5.08,1.75
NANO_V2 = drill 0.9 pad 1.778: 1/D12/MISO 41.808,6.35; 3/D13/SCK 41.808,8.89; 4/+5V 31.75,1.27; 4/COM 31.75,16.51; 4/D11/MOSI 39.268,8.89; 5/A7 29.21,1.27; 5/D2 29.21,16.51; 6/A6 26.67,1.27; 6/COM 39.268,11.43; 6/D3 26.67,16.51; 7/A5 24.13,1.27; 7/D4 24.13,16.51; 8/A4 21.59,1.27; 8/D5 21.59,16.51; 9/A3 19.05,1.27; 9/D6 19.05,16.51; 10/A2 16.51,1.27; 10/D7 16.51,16.51; 11/A1 13.97,1.27; 11/D8 13.97,16.51; 12/A0 11.43,1.27; 12/D9 11.43,16.51; 13/D10 8.89,16.51; 14/D11/MOSI 6.35,16.51; 15/D13 3.81,1.27
POWER-SOP8 = smd 0.4 x 1.6: 1 -0.975,-2.1; 2 -0.325,-2.1; 3 0.325,-2.1; 4 0.975,-2.1; 5 0.975,2.1; 6 0.325,2.1; 7 -0.325,2.1; 8 -0.975,2.1
DIP-08 = drill 0.813 pad 1.727 octagon: 1 -3.81,-3.81; 2 -1.27,-3.81; 3 1.27,-3.81; 4 3.81,-3.81; 5 3.81,3.81; 6 1.27,3.81; 7 -1.27,3.81; 8 -3.81,3.81

### Placement (x,y rotation side)
C1  50.41,19.9 270 top
C2  43.24,38.98 270 top
C3  43.24,34.92 90 top
C4  50.3,38.97 90 top
C5  23.44,54.45 90 top
C6  16.05,64.26 0 top
C7  23.21,65.49 90 top
C8  24.7,65.49 90 top
C9  25.37,69.43 90 top
C10  16.74,59.95 270 top
C11  18.19,59.95 270 top
C12  22.81,47.84 0 top
C13  22.8,49.28 0 top
C14  20.29,48.01 90 top
C15  33.85,59.53 270 top
C16  27.53,57.03 0 top
C17  27.53,55.69 0 top
C18  30.98,46.24 0 top
C19  33.95,46.25 180 top
C20  48.47,51.94 180 top
C21  37.86,56.11 270 top
C22  41.47,56.11 270 top
C23  45.38,56.11 270 top
C24  42.63,47.04 0 top
C25  38.2,47.04 180 top
C26  50.3,34.91 90 top
C27  45.09,4.52 270 top
C28  48.03,5.98 0 top
C29  43.9,4.51 270 top
C30  42.7,4.51 270 top
C33  39.01,62.41 90 top
C34  43.02,61.58 180 top
C35  48.17,61.58 0 top
C36  30.88,70.11 90 top
C37  37.25,68.76 90 top
C38  37.25,65.39 90 top
C39  39.01,70.46 270 top
D1  15.34,53.39 270 top
D2  44.71,10 0 top
D5  62.01,67.77 270 top
D6  62.01,58.85 90 top
DISPLAY  29.75,60 0 top
LDO1  35.26,70.98 270 top
LR3  39.01,65.39 270 top
LR4  41.31,63.24 180 top
MCDC01  46.91,66.32 90 top
R1  18.94,63.34 270 top
R2  13.08,64.26 180 top
R3  7.81,68.99 180 top
R4  23.83,69.42 90 top
R5  26.93,69.41 270 top
R6  19.85,76.28 0 top
R7  26.39,75.03 270 top
R8  25.87,43.26 270 top
R9  17.66,45.53 180 top
R10  18.67,48.06 90 top
R11  16.82,48.05 270 top
R12  50.93,6.85 270 top
R13  53.02,2.27 270 top
R14  39.87,56.11 90 top
R15  27.03,52.38 90 top
R16  24.25,61.31 180 top
R17  28.45,59.55 90 top
R18  32.24,59.53 270 top
R19  30.7,59.53 90 top
R20  47.37,56.11 90 top
R21  48.18,71.62 0 top
R22  45.72,70.75 90 top
R23  50.86,1.4 180 top
R27  48.47,49.68 0 top
R28  19.26,40.47 0 top
R30  43.02,56.11 90 top
R31  43.66,15.32 180 top
R32  43.65,12.98 180 top
RELAY  55.61,64.59 90 top
U1  32,24 0 top
U$1  40.45,50.34 270 top
U$2  46.72,34.04 180 top
U$3  32,5 270 top
U$4  46.72,39.86 180 top
U$6  47.85,27.64 270 top
U$7  51.68,17.43 0 top
U$8  45,77.5 90 top
U$9  54.33,6.42 90 top
U$10  19,57 0 top
U$11  54.42,31.78 90 top
U$12  31.85,48.1 180 top
U$13  19.04,3 90 top
U$14  48.83,3.81 270 top
VFC  17.68,70.2 180 top

### Tracks (layer width: path | path; a pad name or v marks a point on that pad's centre or on a via)
5.5VBUCK
  Top 0.406: C28.2 48.9,3.76 49.17,3.48 U$14.6 52.27,3.48 52.64,3.11 R13.1
  Top 0.61: R12.1 52.97,7.7 U$9.2 | 49.06,7.7 48.9,7.49 C28.2
  Top 0.813: R12.1 49.06,7.7 48.92,7.7 D2.A | C28.2
  Top 1.016: 46.64,9.98 D2.A
+VS  (via drill 0.5, 0.6)
  Top 0.406: U$1.12 42.16,50.99 41.77,50.7 41.77,47.05 C24.1
  Top 0.61: U$4.P$2 45.58,40.31 | U$4.P$2 | U$4.P$2 | C24.1 41.76,45.03 42.41,44.38 v43.23,44.38 43.23,39.87 | v37.89,40.69 22.64,40.69 R8.3 | 14,70.27 12.18,68.43 R2.2 12.18,61.17 14.27,59.08 C10.2 16.75,59.06 | U$12.7 31.85,46.25 C18.2 | U$10.7 19,58.27 C11.2 | 37.89,41.11 36,43 33,43 31.85,44 31.85,46.1 C18.2 | C18.2 | v23.83,71.64 R4.2 23.85,70.27 23.85,70.28 14,70.28 14,70.27 | 14,70.27
  Top 0.813: 43.23,39.87 C2.1 | 24.69,66.36 C8.2 | C8.2 | v37.89,40.69 37.89,41.11 | v26.77,66.38 24.72,66.38 C8.2 | R16.3 21.71,66.17 VFC.8 | C10.2
  Top 1.016: C2.1 U$4.P$2 | C10.2 C11.2 | C19.2 C18.2 | 24.69,66.36 23.23,66.36 C7.2 21.51,66.37 VFC.8
  Bottom 0.406: 35.74,58.83 54.17,58.83 55,58
  Bottom 0.61: 35.74,58.83 29.1,65.94 | 29.1,65.94 29,66.04 | v37.89,40.69 39.86,40.69 v43.23,44.38 48.95,44.38 55.01,50.46 55.01,57.99 55,58 | 28.65,66.38 27.73,67.31 27.73,70.13 26.2,71.66 23.85,71.66 v23.83,71.64 | v26.77,66.38 28.65,66.38 | 28.65,66.38 29.1,65.94
-VS  (via drill 0.6)
  Top 0.406: U$1.3 38.76,50.99 39.08,50.68 C25.1 | R16.1 28.89,63.57 v29.68,62.71
  Top 0.61: 43.33,34.04 C3.1 42.14,34.06 39.99,35.94 40,43 38,45 | 22.62,45.81 R8.1 23.19,45.81 24,45 v27,45 27,47 26.16,47.84 C12.2 23.67,47.85 | C25.1 39.08,46.08 38,45 | 38,45 v36.84,45 | 21.56,51.3 U$10.4 21.54,50.71 v23.68,50.71 | 23.68,49.3 C13.2 | v29.69,57.03 C16.2 C17.2 29.31,54.71 U$12.4
  Top 0.813: v23.68,50.71 23.68,49.3
  Top 1.016: U$2.P$2 43.33,34.04 | C13.2 23.67,47.85
  Bottom 0.406: v23.68,50.71 25.24,52.26 28.05,52.26 29.31,53.52 29.31,56.64 v29.69,57.03
  Bottom 0.61: v36.84,45 v27,45 | v29.68,62.71 v29.69,57.03
A6
  Top 0.61: U1.H2 32,20 26.12,28.35 22.74,28.35 21.84,29 21.84,30.5 20.23,32.21 U$13.5/A7
  Top 0.813: U$13.5/A7
A7
  Top 0.61: U$13.6/A6 18.77,29.67 19.8,28.74 19.8,24.81 20.61,24 U1.V2
BTN  (via drill 0.5)
  Top 0.406: U1.B1A 16.05,36.7 13.52,34.52 v13.52,29.68
  Bottom 0.254: U1.B1A 28.82,36.83
  Bottom 0.406: v13.52,29.68 13.52,24.19 15.65,22.05 U$13.9/A3
CARD_CS
  Bottom 0.254: DISPLAY.5 2.9,61.27 0.9,58.73 0.9,16.07 1.01,15.96 1.5,15.47 U$13.12/D9
COMP_IN
  Top 0.406: VFC.7 18.95,64.2
  Top 1.016: 18.95,64.2 R1.1
D/C
  Top 0.406: U$13.7/D4 4.89,27.13 6,28.25 6,36 4,38 4,45.7 7,48.7 7,63 6.19,63.81 DISPLAY.4 | U$13.7/D4
DGND  (via drill 0.5)
  Top 0.406: 39.04,61.6 C33.1 | MCDC01.9 43.41,68.59 43,69 v43,70 | MCDC01.7 MCDC01.8
  Top 0.61: 39.01,72.98 v39.01,72.92 | 49.03,69.33 MCDC01.8
  Top 0.813: v40.55,61.6 39.04,61.6 | R21.2 v49.03,70.25 49.03,69.33 | C39.1 39.01,72.98
  other vias: 5.85,22.91 5.81,19.69 35.35,75.37 59.64,58.94 61.64,63.94 61.64,54.94 61.64,71.94 57.64,16.94 61.64,7.94 40.64,25.94 40.64,23.94 40.64,21.94 47.46,17.31 35.69,78.79 55.73,29.49 59.64,47.94 59.64,40.94 59.64,32.94 8.17,39.78 7.34,66.88 11.84,48.77
  pour Top (rank 2): 0.5,79.5 9.25,79.5 9.25,5 0.5,5
  pour Bottom (rank 2): 0.5,79.5 9.25,79.5 9.25,5 0.5,5
  pour Top (rank 2): 0.5,44 19,44 19,38 36,38 44.55,30.5 63.5,30.5 63.5,0.5 0.5,0.5
  pour Bottom (rank 2): 0.5,44 19,44 19,38 36,38.01 44.55,30.5 63.5,30.5 63.5,0.5 0.5,0.5
  pour Bottom (rank 2): 57,79.5 57,23 63.5,23 63.5,79.5
  pour Top (rank 2): 57,79.5 63.5,79.5 63.5,23 57,23
  pour Top (rank 2): 0.5,55 9.22,54.8 15.25,48.83 15.25,41.73 0.5,41.73
  pour Bottom (rank 2): 0.5,55 9.16,54.84 15.25,48.87 15.25,41.73 0.5,41.73
  pour Bottom (rank 2): 56.75,79.5 56.75,60.75 37.02,60.75 30,68 30,78 7,78 7,79.5
  pour Top (rank 2): 57,79.5 57,60.75 37,60.75 30,68 30,78 7,78 7,79.5
  pour Top (rank 2): 7,79.5 7,78 30,78 30,68 37,60.75 57,60.75 57,79.5
  pour Top (rank 2): 8.32,79.5 8.32,78 30.04,78 30,75 36.62,75 36.62,75 37,75 37,79.5
  pour Top (rank 2): 8.32,79.5 8.32,78 30,78 30,75 36.62,75 36.62,75 37,75 37,79.5
DGND_IN
  Top 0.61: U$11.2 49.15,26.7 U$6.4
DX
  Top 0.406: R15.1 27.03,50.97 28,50 30.16,50 30.58,49.58 31,50 34,50 34.96,49.04 U$1.6
  Top 0.61: U$12.6 30.58,49.58
FOUT
  Top 0.406: U$13.8/D5 5.54,24.59 7.62,26.67 7.62,35.75 5,38.37 5,45 8.68,48.68 8.68,68.97 | R3.1 8.66,74.7 10.16,76.2 15.24,76.2 16.41,75.03 VFC.3
  Top 0.61: 8.68,68.97 R3.1
GND  (via drill 0.5)
  other vias: 15.23,68.05 43.19,53.65 46.98,47.02 55.73,39.48 55.73,37.48 55.73,35.48 55.73,33.48 55.73,41.48 53.73,42.48 51.73,42.48 37.98,39.02 26.98,39.02 49.81,54.87 41.45,39.88 41.46,36.91 55.73,31.48 49.73,42.48
  pour Top (rank 3): 0.5,0.5 63.5,0.5 63.5,79.5 0.5,79.5
  pour Bottom (rank 3): 0.5,0.5 63.5,0.5 63.5,79.5 0.5,79.5
GNDA  (via drill 0.5)
  Top 0.406: MCDC01.6 48.12,67.29 v47.33,68.08 | R21.1 46.73,71.61
  Top 0.61: v45.48,62.84 44.84,62.84 44,62 44,61.71 C34.1
  Top 0.813: v47.33,68.08 47.33,70.57 R21.1
  Top 1.016: 46.73,71.61 R22.2 | C34.1 C35.1
  other vias: 46.33,65.08
  pour Bottom (isolate 0.254): 48,72 48,60.75 41.75,60.75 41.75,64.88 45,64.88 45,72
IN3
  Top 0.406: RELAY.10 52.48,62.6 51.02,64.06 49.85,64.06 MCDC01.1
IN+INTE
  Top 0.254: 20.31,51.25 20.31,52.31 20.71,52.71 22.13,52.71 22.5,52.35 27.74,52.35 27.93,52.35 28.27,52.69 28.27,54.02 27.96,54.43 22.61,54.43 22.47,54.44 17.8,54.44 16.95,53.42 16.95,50.39 17.34,49.98 20.15,49.98 20.27,50.1 | 20.31,51.25 20.29,51.23 | 20.27,50.19 20.33,50.14 20.33,51.23 U$10.3 20.31,51.25 | 20.27,50.1 20.27,51.32 20.33,51.38 | 20.27,50.1 20.27,50.02 20.29,50
  Top 0.61: U$10.3 20.29,51.27 20.29,50 C14.2
  Top 0.813: C14.2 18.67,48.88 R10.2
IN+TIA
  Top 0.254: 33.88,58.84 53,58.84 54,58 54,53 52,51 52,49 51,48 48.99,48 48.43,48.55 48.43,53.13 49,53.71 50.66,53.71 51.55,54.53 51.55,55.36 51.54,55.36 51.53,55.36 50.87,56.12 35.86,56.12 | 35.86,56.12 35.85,56.12 | 30.6,53.88 30.59,53.88 30.59,53.07 31.18,52.49 33.58,52.49 33.57,52.48 33.94,52.86 33.94,54.42 34.74,55.22 | 35.85,56.12 35.66,56.12 34.74,55.22 | 34.74,55.22 34.72,55.19 | 35.85,56.12 35.86,56.12
  Top 0.406: 33.36,58.42 30.57,55.64 30.57,53.82
  Top 0.61: 30.6,53.83 U$12.3 | 30.59,53.88 30.59,53.83 U$12.3 | C15.2 33.36,58.42 | 30.57,53.82 U$12.3
  Top 1.016: C15.2 32.27,58.66 R18.2
IN-TIA
  Top 0.61: R14.2 | 37.97,56.95 C21.1 | 37.86,56.96 33.7,56.96 31.84,55.1 31.84,54.82 U$12.2
  Top 0.813: R27.2
  Top 1.016: C21.1 37.86,56.96 R14.2 C22.1 R30.2 43.02,57.06 C23.1 45.38,56.96 R20.2 RELAY.12 52.48,53.6 50.82,51.94 C20.1
  Top 1.27: R27.2 C20.1
INT_RDY
  Bottom 0.406: U$13.13/D10 7.16,11.89 10.16,8.89 27.94,8.89 29.21,7.62 29.21,6.52 U$3.7
  Bottom 0.61: U$13.13/D10
IPD
  Top 0.813: 45,77.44 U$8.SIG_T
  Top 1.016: RELAY.7 52.49,71.74 50.48,73.75 46.25,73.75 45,75 45,77.44
LDO_OUT3V1
  Top 0.406: C37.2 37.25,70.5 36.64,70.97 35.28,70.97
  Top 0.61: 35.28,70.97 LDO1.5
  Top 1.016: C38.2 LR3.1 C39.2 C37.2
LITE
  Top 0.406: DISPLAY.10 4.09,48.54 2.54,46.99 2.54,38.1 4.76,35.88 4.76,30.8 3.46,29.7 U$13.6/D3
MISO  (via drill 0.5)
  Top 0.406: 12.5,45.01 12.5,46.5 11.95,47.02 9.45,47.02 v8.45,46.02
  Top 0.61: 12.5,45.01 U$13.1/D12/MISO
  Bottom 0.406: DISPLAY.9 6.11,51.08 8.46,48.73 8.46,47.03 v8.45,46.02
MOSI
  Bottom 0.406: DISPLAY.7 3.16,56.16 2.5,55.5 2.5,46.68 3.81,45.37 7.05,45.37 U$13.4/D11/MOSI
MOSI_I2C_ADD
  Bottom 0.406: U$13.14/D11/MOSI 7.16,9.35 12.7,3.81 26.84,3.81
  Bottom 0.61: 26.84,3.81 U$3.10
N$1
  Top 0.406: LDO1.4 35.26,68.47 35.85,67.91 36.95,67.91
  Top 0.61: 36.95,67.91 C37.1
N$2
  Top 0.406: C5.2 20.87,55.3 20.26,55.9 19.65,55.29 D1.C | U$10.6 20.27,61.16 R1.2
  Top 0.61: 20.26,55.9 U$10.6
N$4
  Top 0.61: 50.33,39.82 C4.2 | 47.89,39.84 U$4.P$1
  Top 1.016: U$11.6 52.67,38.98 51.84,39.82 50.33,39.82 | C4.2 47.89,39.84
N$5
  cutout Top (rank 2): 38.22,79.5 38.22,60.75 56.75,60.75 56.75,79.5
N$6
  Top 0.61: U$2.P$1
  Top 1.016: U$2.P$1 C26.1 50.31,32.74 51.27,31.78 U$11.4
N$7
  Top 0.406: 53.01,1.41 R13.2 | U$14.5 51.16,2.83 51.72,2.27 51.72,1.41 R23.1
  Top 1.016: R23.1 R13.2
N$8
  Top 0.406: 13.87,64.24 R2.1
  Top 0.813: C6.1 R2.1 14,64.26 14,66 13.87,66 VFC.5
N$10
  Top 0.813: VFC.2 18.95,75.72 R6.1
N$11
  Top 0.61: R4.1 17.84,68.57 17,67.73 17,66.98 VFC.6
  Top 1.016: 23.85,68.55 R4.1 23.84,68.58 24.13,68.58 24.15,68.56 C9.1 R5.2
N$12
  Top 0.813: R6.2 R7.1
N$14
  Top 0.813: R10.1 R11.2 R9.2
N$15
  Top 0.61: R8.2 21.78,43.26 19.5,45.54 R9.1
  Top 0.813: R9.1
N$17
  Top 0.406: U$14.8 R12.2
N$18
  Top 0.406: U$14.7 53.49,4.13 U$9.1
N$21
  Top 0.813: R19.2
  Top 1.016: R19.2 R18.1 | R17.2 R19.2
N$22
  Top 0.813: R17.1 24.41,58.68 R16.2
OUT_TIA  (via drill 0.6)
  Top 0.406: R15.2 26.66,53.6 C5.1 19.6,53.6 19,52 | 19,52.31 v18,53.31
  Top 0.61: U$10.2 19,52 19,52.31
  Top 0.813: R15.2
  Bottom 0.61: VFC.1 21.49,73.22 20,71.73 13,71.73 10.5,69.53 10.5,55.5 13,53.31 v18,53.31
READY  (via drill 0.5)
  Top 0.406: MCDC01.12 v41.01,66.64 | v42,2 41.18,1 24.4,1 21.59,3.81 21.59,7.62 20.32,8.89 13.97,8.89 11.43,11.43 11.43,30.45 v9.71,32.17
  Bottom 0.305: 62.72,58.36 60.59,60.42 39.48,60.42 38,62
  Bottom 0.406: 38,62 38,65 39.64,66.64 v41.01,66.64 | 62.72,58.36 63,58.08 63,13.47 56.37,6.38 56.37,3 55.17,2 v42.01,2 v42,2 | 9.68,32.21 U$13.5/D2
  Bottom 0.61: 9.68,32.21 v9.71,32.17 | U$13.5/D2
REXT
  Top 0.406: MCDC01.5 47.36,66.64 47,67 46.99,67 45.71,68.29 45.71,69.88 R22.1
S1
  Top 0.406: U$1.4 36.49,50.35 36,50.84 36,53 36.58,53.68 41.13,53.68 41.47,54.02 C22.2
  Top 0.813: R30.1 C22.2
S2
  Top 0.406: U$1.5 35.89,49.7 34.78,50.78 34.79,53.56 36.39,55.16 C21.2
  Top 0.61: 37.96,55.26 C21.2
  Top 0.813: R14.1 37.96,55.26
S3
  Top 0.406: U$1.11 44.34,50.34 45.38,51 C23.2
  Top 0.61: 45.58,55.24 C23.2
  Top 0.813: R20.1 45.58,55.24
S4
  Top 0.406: R27.1 43.38,49.68 U$1.10
  Top 0.61: C20.2
  Top 1.016: R27.1
  Top 1.27: C20.2 R27.1
SCL
  Top 0.406: U$3.6 31,2 25.94,2 24.13,3.81 24.13,7.62 21.59,10.16 15.24,10.16 13.33,12.07 13.33,24.5 15.65,27.14 U$13.7/A5 | U$13.7/A5 | U$13.7/A5
SDA
  Top 0.406: U$3.5 32,7 30.11,8.89 25.4,8.89 22.48,11.81 16.35,11.81 15,13.12 15,23.6 16.01,24.6 U$13.8/A4 | U$13.8/A4 | U$13.8/A4
SOFT_SCL  (via drill 0.5)
  Top 0.254: 53,17.48 U$7.6
  Top 0.305: R32.1 44.5,13.3 44.83,13 | 53,17.38 U$7.6 | 51.66,14 v51.68,13.98
  Top 0.406: 53,17.48 53,15.3 v51.68,13.98 | 44.83,13 48,13 49,14 51.66,14 | MCDC01.11 42.71,67.29 42,68 v41.01,68
  Bottom 0.254: 37.91,60 56.14,60 58,58
  Bottom 0.305: 58,58 58,54 | 51.63,13.99 v51.68,13.98 | 37.91,60 36,62
  Bottom 0.406: 58,54 62,50 62,30 53,21 53,15.3 v51.68,13.98 | 51.63,13.99 48.98,13.98 46,10.75 10.07,10.75 6,14.81 6,18 4.48,19.5 U$13.10/D7 | 36,62 36,65.78 38.22,68 v41.01,68
  Bottom 0.61: U$13.10/D7
SOFT_SDA  (via drill 0.5)
  Top 0.254: 51.7,17.45 U$7.7
  Top 0.305: 51.68,16.35 v50.68,15.32
  Top 0.406: v50.68,15.32 R31.1 | U$7.7 51.68,16.35 | MCDC01.10 43.06,67.94 41,70 v40.7,70
  Bottom 0.254: 36.94,59.5 55.71,59.5 57.35,57.67
  Bottom 0.305: 57.35,57.67 57.35,53.67 | 36.94,59.5 34,62.57
  Bottom 0.406: 57.35,53.67 61,50 61,30.25 51.7,20.95 51.7,16.37 v50.68,15.32 48.76,15.35 45.41,11.75 10.48,11.75 7,15.27 7,20 5.06,22.08 2.54,22.08 | 34,62.57 34,66 38,70 v40.7,70
  Bottom 0.61: 2.54,22.08 U$13.9/D6
SPI_CLK_I2C_ADD
  Bottom 0.406: U$13.15/D13 26.38,6.81
  Bottom 0.61: 26.38,6.81 U$3.9
SPI_SCK
  Bottom 0.406: DISPLAY.8 6.07,53.62 10.16,49.53 U$13.3/D13/SCK
  Bottom 0.61: U$13.3/D13/SCK
SW_A0  (via drill 0.5)
  Top 0.254: v40.24,52.34 U$1.1
  Top 0.305: U$1.1
  Bottom 0.254: 32,38 40.53,45.54 40.53,52.05 v40.24,52.34 | 20.78,14.45 20.69,14.45 | 26,15
  Bottom 0.406: 32,38 32,21.84 26,15 25.45,14.45 20.78,14.45 | 20.69,14.45 20.28,14.45 U$13.11/A1
SW_A1  (via drill 0.5)
  Top 0.305: U$1.14 v41.83,52.34
  Bottom 0.254: v41.83,52.34 41.83,51.83 41,51 41,45.01 33.27,38
  Bottom 0.406: 33.27,38 33.27,21.16 27,14 26,13 19.21,13 U$13.12/A0
SW_EN  (via drill 0.5)
  Top 0.305: 39.36,51.64 39,51.64 | 39,51.64 U$1.2 | v39.2,51.64 39,51.64
  Top 0.406: v31,25 33,28 42.94,28 44.56,29.63 48.74,29.63 49.2,28.58
  Top 0.61: U$6.6 49.2,28.58
  Bottom 0.254: v39.2,51.64 39.5,51.5 40,51 40,46 31,38
  Bottom 0.406: 31,38 v31,25 31,22.35 28.48,19.5 18.2,19.5 17.78,19.5
  Bottom 0.61: 17.78,19.5 U$13.10/A2
TFT_CS
  Top 0.254: DISPLAY.6 2.9,58.73 0.9,56.07 0.9,18.61 U$13.11/D8
V_IN_BUCK  (via drill 0.8)
  Top 0.406: U$14.3 46.22,3.48 | U$14.2 46.73,4 46.22,3.48 | 46.22,3.48 45.09,3.48 C27.2
  Top 0.813: 40.35,3.61 42.7,3.61
  Top 1.016: 40.35,3.61 v40.32,3.6 | 42.7,3.61 C30.2 C29.2 | C29.2 | C29.2 C27.2
  Bottom 0.813: 40.32,3.32 39,1.5 30.54,1.5 29.54,3 29.54,3.65 U$3.8
  Bottom 1.016: v40.32,3.6 40.32,3.32
VDD
  Top 0.406: MCDC01.14 41.34,65.34 40.44,64.44 40.44,63.27 LR4.2
  Top 0.61: 39,64.59 LR3.2
  Top 1.016: LR3.2 C33.2 40.44,63.27
VDDA
  Top 0.406: MCDC01.15 42.69,64.69 42,64 42,63.41 LR4.1 | 42.16,61.59 C34.2
  Top 1.016: LR4.1 42.16,61.59
VPD
  Top 0.254: 51.04,68.85 51.04,71.36 49.63,72.76 45.53,72.76 43.99,74.3 43.98,74.3 43.98,74.32 43.43,74.87 | 51.04,68.85 51.9,67.99 53.16,67.99 53.99,69.16 54,69.17 54,72 51.16,74.84 | 49,63 50,63 51,62 51,61.51 52.03,60.74 53.03,60.74 53.97,61.61 54,63 51.04,65.96 51.04,68.85 | 49,63 48.53,63.42 48.53,65.42 | 51.16,74.84 46.92,74.84 46.91,74.85 | 51.18,74.84 51.16,74.84 | 49.02,61.98 49.02,62.98 49,63
  Top 0.406: MCDC01.16 46.96,64.04 49.02,61.98 C35.2
VUSB5V  (via drill 0.5)
  Top 0.305: LDO1.3 33.66,69.07 33.85,69.34 33.85,70.74 33.62,70.97 LDO1.1
  Top 0.406: U$11.1
  Top 0.61: U$6.5 50.16,27.64 51.18,29 54,29 54.67,28.32 54.67,25.15 53.68,24.16 U$11.1 | U$7.8 50.41,19.19 C1.2 47.47,19.02 | v30.89,78.75 C36.2 30.9,70.98 LDO1.1 | R3.2 5.09,68.98 5.08,69
  Top 0.813: U1.H1 | R31.2 42.81,13.4 R32.2 42.8,10.01 | 42.83,15.34 R31.2 | U1.V1 24.43,26.54 29.46,19.42 29.46,13.94 29.46,12.97 32.42,10.01 D2.C | U$11.1 52.66,24.15 49.69,24.15 47.47,21.93 47.47,19.02 44.45,19.02 42.81,17.41 R31.2
  Top 1.016: 29.46,13.94 U1.H1 | D2.C 42.8,10.01
  Bottom 0.61: DISPLAY.2 4.46,69 6,69 8.27,71.27 8.27,77.81 9.06,78.75 v30.89,78.75 32.44,78.75 33.5,77.5 U$8.GND_B@1
  Bottom 0.813: U1.V1 21.84,33.54 20.61,34.74 17.78,34.74 | 4.7,66 6,66 8.49,63.51 8.49,54.83 14.53,48.79 14.53,44.73 14.5,44.7 14.5,35.8 15.57,34.74 15.58,34.75 U$13.4/+5V | U$8.GND_B@1
  Bottom 1.27: U1.V1 | 4.7,66 DISPLAY.3 | U$13.4/+5V 17.78,34.74
  pour Bottom (isolate 0.406): 41.5,80 41.5,75.35 48.55,75.35 48.55,80
  pour Top: 3,70 3,65.25 6,65.25 6,70
  pour Bottom: 3,70 3,65.25 6,65.25 6,70
X_RELAY
  Top 0.406: 54.25,17.46 U$7.5 | U$7.3
  Top 0.61: U$7.5 54.22,14.83 52.95,13.56 U$7.3 | U$7.5 54.21,21.03 57.75,24.57 57.75,67.43 RELAY.6
  Top 0.813: 60.08,69.67 RELAY.6
  Top 1.016: 60.08,69.67 D5.C
Y_RELAY
  Top 0.406: U$7.1
  Top 0.61: 61.96,56.97 D6.C | 52,10 58,10 59.47,11.47 61,13 61,52 59.74,53.26 RELAY.1 | 52,10 51.29,10 50.41,10.88 U$7.1 | U$7.2 51.68,10.32 52,10
  Top 1.016: RELAY.1 61.96,56.97